# Altium project IoTProject_V1.1.PrjPcb (part 1 of 2)
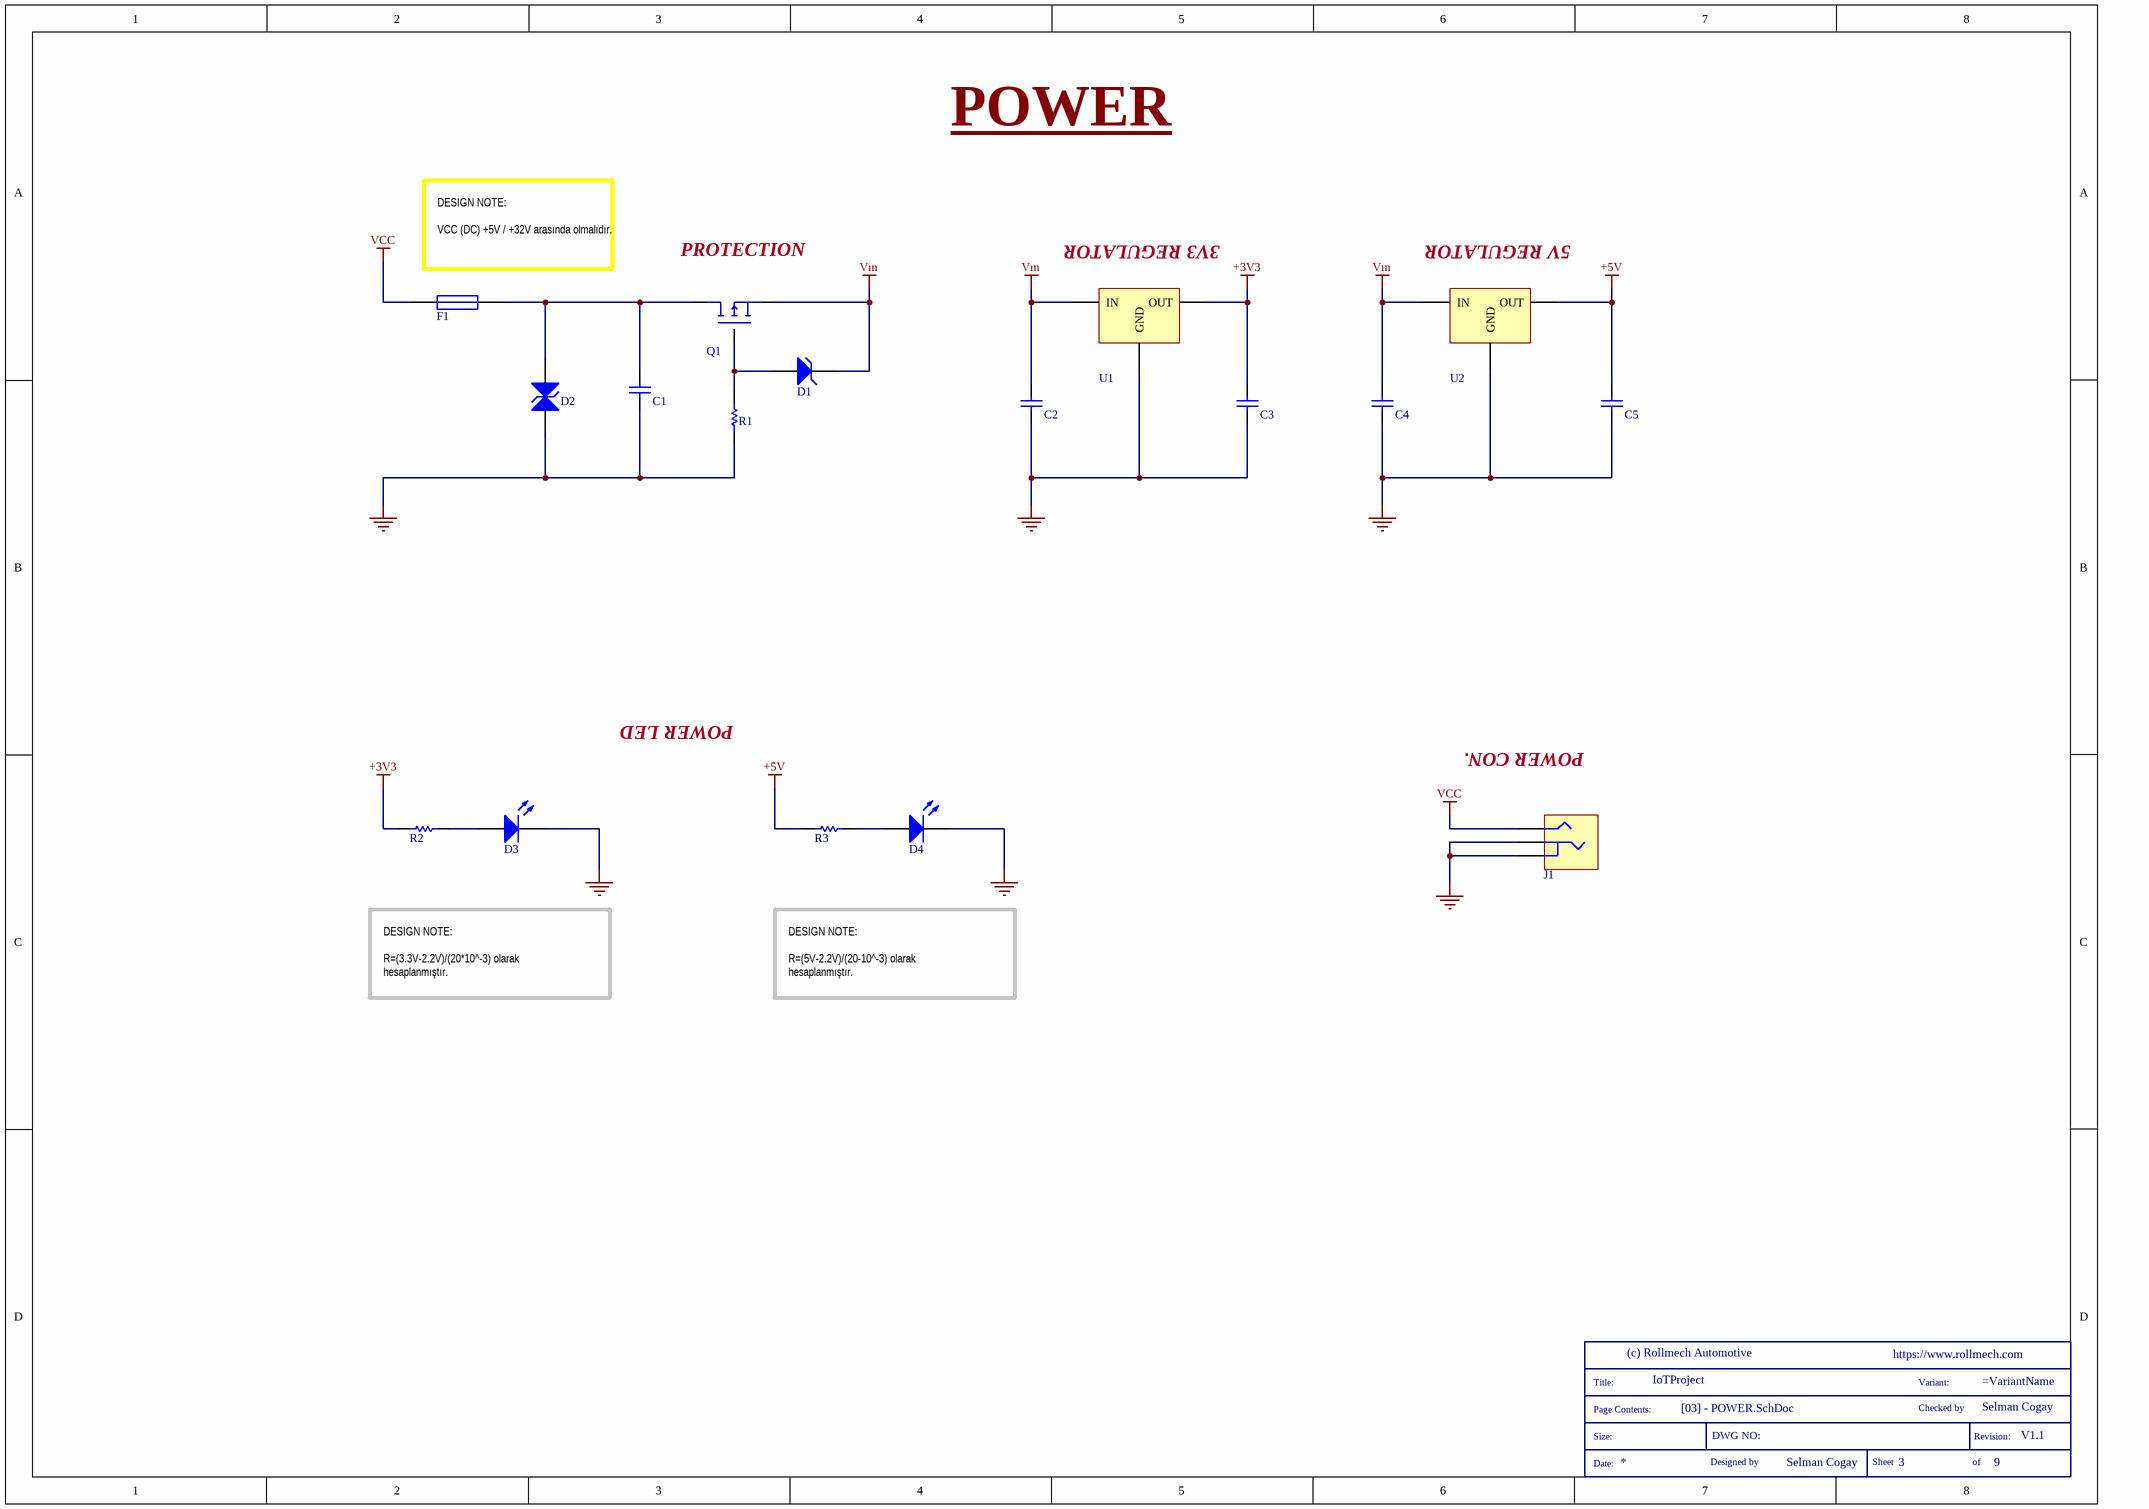
[diagram p0: [03] - POWER.SchDoc]
Company: (c) Rollmech Automotive; Designer: Selman Cogay; Proje: IoT-Project; Project: IoTProject; Released_Date: Released Date: 01.09.2020; VersionRevision: V1.1; WebSite: https://www.rollmech.com
6 sheets, 231 parts. Net scope: flat (ports and power ports of the same name join across sheets).
Sheets:
  [03] - POWER.SchDoc
  [04] - COMMUNICATION.SchDoc
  [05] - EEPROM-RTC-LCD.SchDoc
  [06] - INPUT.SchDoc
  [07] - OUTPUT.SchDoc
  [08] - MCU.SchDoc

## Sheet [03] - POWER.SchDoc
size A3; DocumentNumber: 3; SheetNumber: 3; SheetTotal: 9

### Parts
(Parts that share a designator on the sheet are numbered #1, #2 ... from top to bottom, then left to right.)
*#1  SCH_TITLE  (value not drawn)  (graphical)
C1  1uF 35V  [C0603]  (value not drawn)
C2  100nF 35V  [CAP_CER_0603]  (value not drawn)
C3  10uF 16V  [CAP_CER_0805]  (value not drawn)
C4  100nF 35V  [CAP_CER_0603]  (value not drawn)
C5  10uF 16V  [CAP_CER_0805]  (value not drawn)
D1  12V 250mW  [SOT-23 (TO-236)]  (value not drawn)
D2  33V3  [DO-214AB]  (value not drawn)
D3  LED RED  [PLCC2]  (value not drawn)
D4  LED RED  [PLCC2]  (value not drawn)
F1  1.25A 32VDC  [FUSE_0603]  (value not drawn)
J1  CONN 2x5.5 Jack  [POWER_JACK]  (value not drawn)
Q1  PNP 60V 36A  [PowerPak-SO8]  (value not drawn)
R1  100K 1/4W  [RES_0603]  (value not drawn)
R2  54.9 1/8W  [RES_0805]  (value not drawn)
R3  140 1/8W  [RES_0805]  (value not drawn)
U1  TLE4284DV33  [PG-TO252-3-11]  (value not drawn)
U2  TLE4284DV50  [PG-TO252-3-11]  (value not drawn)

### Nets
+3V3: C3.2 R2.1 U1.2(OUT)
+5V: C5.2 R3.1 U2.2(OUT)
GND: C1.1 C2.1 C3.1 C4.1 C5.1 D2.1(A) D3.2(K) D4.2(K) J1.2 J1.3 R1.1 U1.1(GND) U2.1(GND)
VCC: F1.1 J1.1
Vın: C2.2 C4.2 D1.3(K) Q1.1(S) U1.3(IN) U2.3(IN)
NetC1_2: C1.2 D2.2(K) F1.2 Q1.5(D)
NetD1_2: D1.2(A) Q1.4(G) R1.2
NetD3_1: D3.1(A) R2.2
NetD4_1: D4.1(A) R3.2

### Notes on the sheet
- POWER
- (near U1) 3V3 REGULATOR
- (near U2) 5V REGULATOR
- (near F1) DESIGN NOTE:
  VCC (DC) +5V / +32V arasında olmalıdır.
- (near Q1) PROTECTION
- POWER LED
- POWER CON.
- DESIGN NOTE:
  R=(3.3V-2.2V)/(20*10^-3) olarak hesaplanmıştır.
- DESIGN NOTE:
  R=(5V-2.2V)/(20-10^-3) olarak hesaplanmıştır.
- (in symbol SCH_TITLE) Title:; Variant:; Page Contents:; Checked by; Size:; DWG NO:; Revision:; Date:; Designed by; Sheet; of

### Library data of the parts
*#1 = SCH_TITLE: Schematic information
C1 = CGA3E3X5R1V105K080AB: CAP CER 1UF 35V; Manufacturer 1: TDK Corporation; Category: Ceramic Capacitors; Manufacture Part Number 1: CGA3E3X5R1V105K080AB; Case/Package: 0603 (1608 Metric); Quantity: 1; Supplier 1: Digikey; Supplier Part Number 1: 445-12484-1-ND; Supplier Order Qty 1: 1; Supplier Stock 1: 11910; Supplier Unit Price 1: 0,25; Supplier Currency 1: $
C2 C4 = GMK107BJ104KAHT: CAP CER 100nf 35V X5R 0603; Manufacturer 1: Taiyo Yuden; Category: Ceramic Capacitors; Manufacturer Part Number 1: GMK107BJ104KAHT; Case/Package: 0603 (1608 Metric); Quantity: 1; Supplier 1: Digikey; Supplier Part Number 1: 587-3357-1-ND; Supplier Order Qty 1: 1; Supplier Stock 1: 97932; Supplier Unit Price 1: 0,14; Supplier Currency 1: $
C3 C5 = CGA4J1X5R1C106M125AC: CAP CER 10UF 16V; Manufacturer 1: TDK Corporation; Category: Ceramic Capacitors; Manufacturer Part Number 1: CGA4J1X5R1C106M125AC; Case/Package: 0805 (2012 Metric); Quantity: 1; Supplier 1: Digikey; Supplier Part Number 1: 445-12654-1-ND; Supplier Order Qty 1: 1; Supplier Stock 1: 39905; Supplier Unit Price 1: 0,5; Supplier Currency 1: $
D1 = SZBZX84C12LT1G: DIODE ZENER 12V 250MW; Manufacturer 1: ON Semiconductor; Category: Diodes - Zener - Single; Manufacturer Part Number 1: SZBZX84C12LT1G; Case/Package: TO-236-3, SC-59, SOT-23-3; Quantity: 1; Supplier 1: Digikey; Supplier Part Number 1: SZBZX84C12LT1GOSCT-ND; Supplier Order Qty 1: 1; Supplier Stock 1: 80986; Supplier Unit Price 1: 0,15; Supplier Currency 1: $
D2 = SZP6SMB36CAT3G: TVS DIODE 30.8V 49.9V SMB; Manufacturer 1: Littelfuse Inc.; Category: TVS - Diodes; Manufacturer Part Number 1: SZP6SMB36CAT3G; Case/Package: DO-214AA, SMB; Quantity: 1; Supplier 1: Digikey; Supplier Part Number 1: SZP6SMB36CAT3GOSCT-ND; Supplier Order Qty 1: 1; Supplier Stock 1: 24611; Supplier Unit Price 1: 0,93; Supplier Currency 1: $
D3 D4 = LR T67D-U1V2-1-1-20-R18-Z: LED TOPLED RED 626NM 2PLCC; Manufacturer 1: OSRAM Opto Semiconductors Inc.; Category: LED Lighting - Color; Manufacturer Part Number 1: LR T67D-U1V2-1-1-20-R18-Z; Case/Package: 2-SMD, J-Lead; Quantity: 1; Supplier 1: Digikey; Supplier Part Number 1: 475-3762-1-ND; Supplier Order Qty 1: 1; Supplier Stock 1: 1905; Supplier Unit Price 1: 0,47; Supplier Currency 1: $
F1 = MFU0603FF01250P100: FUSE 1.25A 32VDC 0603; Manufacturer 1: Vishay Beyschlag; Category: Fuses; Manufacturer Part Number 1: MFU0603FF01250P100; Case/Package: 0603 (1608 Metric); Quantity: 1; Supplier 1: Digikey; Supplier Part Number 1: MFU06031.25CT-ND; Supplier Order Qty 1: 1; Supplier Stock 1: 24954; Supplier Unit Price 1: 0,31; Supplier Currency 1: $
J1 = PJ-002A: CONN PWR JACK 2X5.5MM SOLDER; Manufacturer 1: CUI Inc.; Category: Barrel - Power Connectors; Manufacturer Part Number 1: PJ-002A; Case/Package: Jack; Quantity: 1; Supplier 1: Digikey; Supplier Part Number 1: CP-002A-ND; Supplier Order Qty 1: 1; Supplier Stock 1: 115179; Supplier Unit Price 1: 0,6; Supplier Currency 1: $
Q1 = SQJ457EP-T1_GE3: MOSFET P-CH 60V 36A; Manufacturer 1: Vishay Siliconix; Category: Transistors - FETs, MOSFETs - Single; Manufacturer Part Number 1: SQJ457EP-T1_GE3; Case/Package: PowerPAK® SO-8; Quantity: 1; Supplier 1: Digikey; Supplier Part Number 1: SQJ457EP-T1_GE3CT-ND; Supplier Order Qty: 1; Supplier Stock 1: 24220; Supplier Unit Price 1: 0,92; Supplier Currency 1: $
R1 = ERJ-PA3J104V: RES SMD 100K 5% 1/4W 0603; Manufacturer 1: Panasonic Electronic Components; Category: Chip Resistor - Surface Mount; Manufacturer Part Number 1: ERJ-PA3J104V; Case/Package: 0603 (1608 Metric); Quantity: 1; Supplier 1: Digikey; Supplier Part Number 1: P100KBZCT-ND; Supplier Order Qty 1: 1; Supplier Stock 1: 11465; Supplier Unit Price 1: 0,11; Supplier Currency 1: $
R2 = ERJ-6ENF54R9V: RES SMD 54.9 OHM; Manufacturer 1: Panasonic Electronic Components; Category: Chip Resistor - Surface Mount; Manufacturer Part Number 1: ERJ-6ENF54R9V; Case/Package: 0805 (2012 Metric); Quantity: 1; Supplier 1: Digikey; Supplier Part Number 1: P54.9CCT-ND; Supplier Order Qty 1: 1; Supplier Stock 1: 43715; Supplier Unit Price 1: 0,1; Supplier Currency 1: $
R3 = ERJ-6ENF1400V: RES SMD 140 OHM 1% 1/8W 0805; Manufacturer 1: Panasonic Electronic Components; Category: Chip Resistor - Surface Mount; Manufacturer Part Number 1: ERJ-6ENF1400V; Case/Package: 0805 (2012 Metric); Quantity: 1; Supplier 1: Digikey; Supplier Part Number 1: P140CCT-ND; Supplier Order Qty 1: 1; Supplier Stock 1: 76818; Supplier Unit Price 1: 0,1; Supplier Currency 1: $
U1 = TLE4284DV33ATMA1: IC REG LINEAR 3.3V 1A; Manufacturer 1: Infineon Technologies; Category: PMIC - Voltage Regulators - Linear; Manufacturer Part Number 1: TLE4284DV33ATMA1; Case/Package: TO-252-3, DPak (2 Leads + Tab), SC-63; Quantity: 1; Supplier 1: Digikey; Supplier Part Number 1: TLE4284DV33ATMA1CT-ND; Supplier Order Qty 1: 1; Supplier Stock 1: 5062; Supplier Unit Price 1: 1,77; Supplier Currency 1: $
U2 = TLE4284DV50ATMA1: IC REG LINEAR 5V 1A; Manufacturer 1: Infineon Technologies; Category: PMIC - Voltage Regulators - Linear; Manufacturer Part Number 1: TLE4284DV50ATMA1; Case/Package: TO-252-3, DPak (2 Leads + Tab), SC-63; Quantity: 1; Supplier 1: Digikey; Supplier Part Number 1: TLE4284DV50ATMA1CT-ND; Supplier Order Qty 1: 1; Supplier Stock 1: 2563; Supplier Unit Price 1: 1,77; Supplier Currency 1: $

## Sheet [04] - COMMUNICATION.SchDoc
size A3; DocumentNumber: 4; SheetNumber: 4; SheetTotal: 9
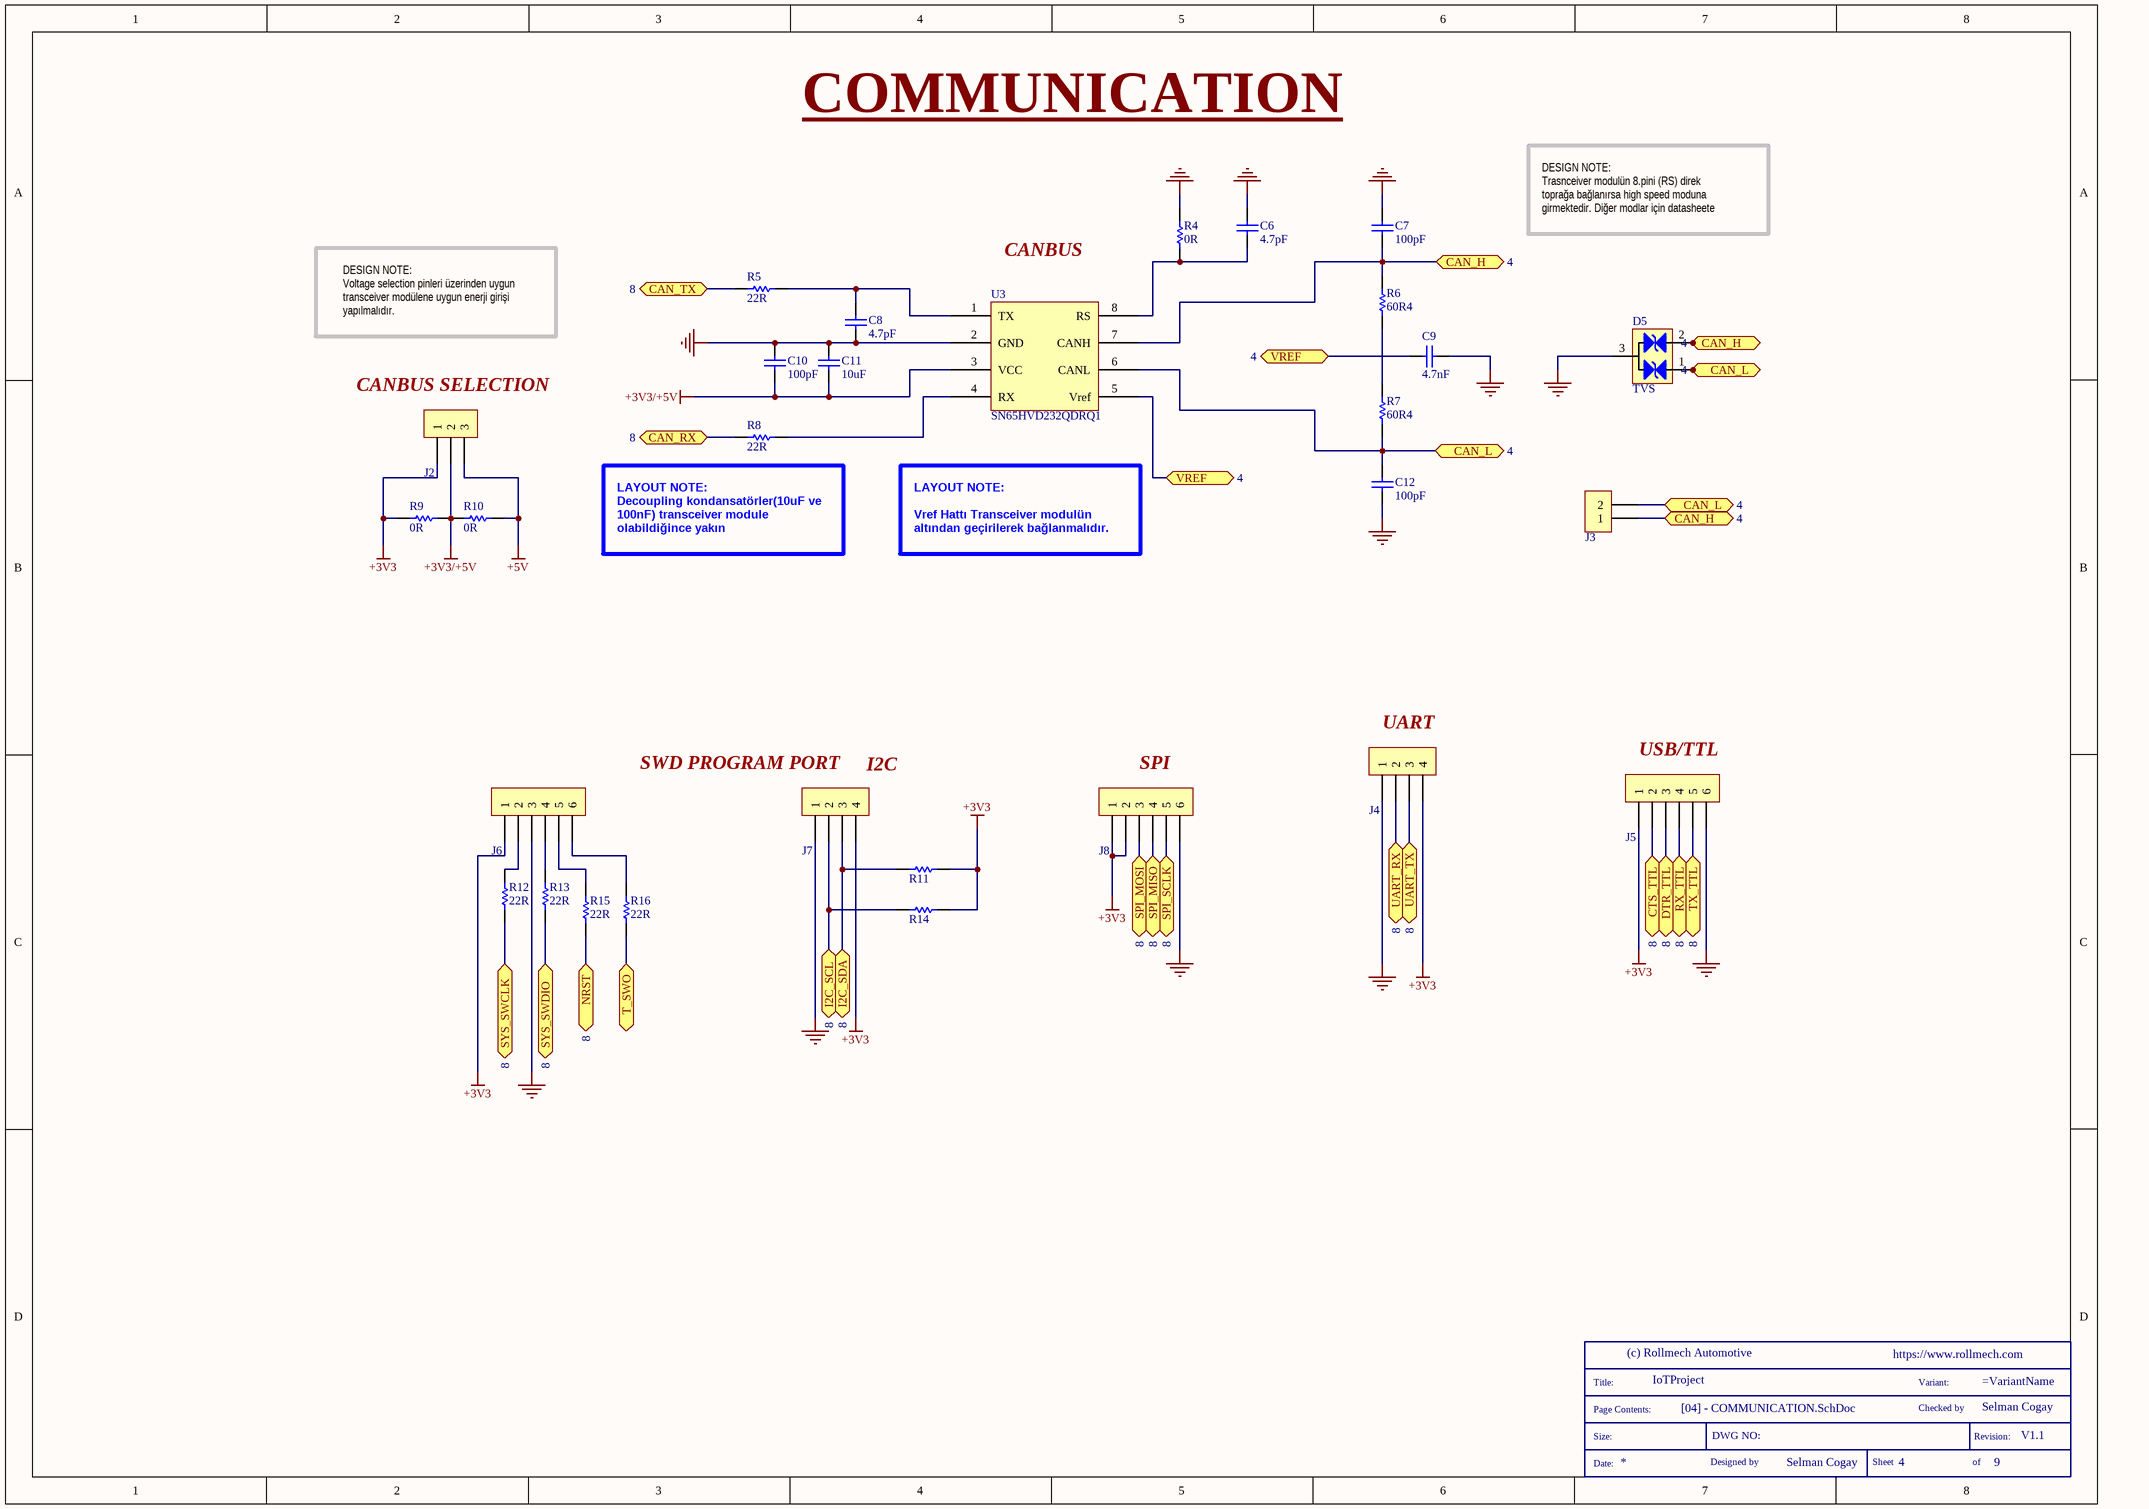
[diagram p1: [04] - COMMUNICATION.SchDoc]

### Parts
(Parts that share a designator on the sheet are numbered #1, #2 ... from top to bottom, then left to right.)
*#2  SCH_TITLE  (value not drawn)  (graphical)
C6  4.7pF  [C0603]
C7  100pF  [C0805]
C8  4.7pF  [C0603]
C9  4.7nF  [C0603]
C10  100pF  [C0805]
C11  10uF  [C0805]
C12  100pF  [C0805]
D5  TVS  [SOT23-3]
J2  HDR_1X3_2.54  [HDR_MALE_1X3_2.54MM]  (value not drawn)
J3  PPTC021LFBN-RC  [2POS_2.54mmPitch]  (value not drawn)
J4  HDR FEMALE 1X4 2.54MM  [HDR_FEMALE_1X4_2.54MM]  (value not drawn)
J5  HDR FEMALE 1X6 2.54MM  [HDR_FEMALE_1X6_2.54MM]  (value not drawn)
J6  HDR FEMALE 1X6 2.54MM  [HDR_FEMALE_1X6_2.54MM]  (value not drawn)
J7  HDR FEMALE 1X4 2.54MM  [HDR_FEMALE_1X4_2.54MM]  (value not drawn)
J8  HDR FEMALE 1X6 2.54MM  [HDR_FEMALE_1X6_2.54MM]  (value not drawn)
R4  0R  [R0805]
R5  22R  [R0805]
R6  60R4  [R0805]
R7  60R4  [R0805]
R8  22R  [R0805]
R9  0R  [R0805]
R10  0R  [R0805]
R11  5.6k 1/8W  [RES_0805]  (value not drawn)
R12  22R  [R0805]
R13  22R  [R0805]
R14  5.6k 1/8W  [RES_0805]  (value not drawn)
R15  22R  [R0805]
R16  22R  [R0805]
U3  SN65HVD232QDRQ1  [SOIC8]

### Ports
CAN_H (see 4), CAN_L (see 4), CAN_RX (see 8), CAN_TX (see 8), CTS_TTL (see 8), DTR_TTL (see 8), I2C_SCL (see 8), I2C_SDA (see 8), NRST (see 8), RX_TTL (see 8), SPI_MISO (see 8), SPI_MOSI (see 8), SPI_SCLK (see 8), SYS_SWCLK (see 8), SYS_SWDIO (see 8), T_SWO, TX_TTL (see 8), UART_RX (see 8), UART_TX (see 8), VREF (see 4)

### Nets
+3V3: J2.1 J4.4 J5.1 J6.1 J7.4 J8.1 J8.2 R9.1 R11.2 R14.2
+3V3/+5V: C10.1 C11.1 J2.2 R9.2 R10.2 U3.3(VCC)
+5V: J2.3 R10.1
GND: C6.2 C7.2 C8.1 C9.2 C10.2 C11.2 C12.1 D5.3 J4.1 J5.6 J6.3 J7.1 J8.6 R4.2 U3.2(GND)
NetC6_1: C6.1 R4.1 U3.8(RS)
NetC7_1: C7.1 J3.1 R6.2 U3.7(CANH) ; port CAN_H
NetC8_2: C8.2 R5.2 U3.1(TX)
NetC9_1: C9.1 U3.5(Vref) ; port VREF
NetC12_2: C12.2 J3.2 R7.1 U3.6(CANL) ; port CAN_L
NetC19_1: R15.1 ; port NRST
NetJ4_2: J4.2 ; port UART_RX
NetJ4_3: J4.3 ; port UART_TX
NetJ5_2: J5.2 ; port CTS_TTL
NetJ5_3: J5.3 ; port DTR_TTL
NetJ5_4: J5.4 ; port RX_TTL
NetJ5_5: J5.5 ; port TX_TTL
NetJ6_2: J6.2 R12.2
NetJ6_4: J6.4 R13.2
NetJ6_5: J6.5 R15.2
NetJ6_6: J6.6 R16.2
NetJ7_2: J7.2 R14.1 ; port I2C_SCL
NetJ7_3: J7.3 R11.1 ; port I2C_SDA
NetJ8_3: J8.3 ; port SPI_MOSI
NetJ8_4: J8.4 ; port SPI_MISO
NetJ8_5: J8.5 ; port SPI_SCLK
NetR5_1: R5.1 ; port CAN_TX
NetR6_1: R6.1 R7.2
NetR8_1: R8.1 ; port CAN_RX
NetR8_2: R8.2 U3.4(RX)
NetR12_1: R12.1 ; port SYS_SWCLK
NetR13_1: R13.1 ; port SYS_SWDIO
NetR16_1: R16.1 ; port T_SWO

Not connected (* = marked no-connect by the designer): D5 1 2

### Notes on the sheet
- COMMUNICATION
- DESIGN NOTE:
  Trasnceiver modulün 8.pini (RS) direk toprağa bağlanırsa high speed moduna girmektedir. Diğer modlar için datasheete bakınız
- CANBUS
- DESIGN NOTE:
  Voltage selection pinleri üzerinden uygun transceiver modülene uygun enerji girişi yapılmalıdır.
- (near J2) CANBUS SELECTION
- (near R8) LAYOUT NOTE:
  Decoupling kondansatörler(10uF ve 100nF) transceiver module olabildiğince yakın konumlandırılmalıdır.
- LAYOUT NOTE:
  Vref Hattı Transceiver modulün altından geçirilerek bağlanmalıdır.
- (near J6) SWD PROGRAM PORT
- (near J7) I2C
- (near J8) SPI
- (near J4) UART
- (near J5) USB/TTL
- (in symbol SCH_TITLE) Title:; Variant:; Page Contents:; Checked by; Size:; DWG NO:; Revision:; Date:; Designed by; Sheet; of

### Library data of the parts
*#2 = SCH_TITLE: Schematic information
C6 C8 = CGA3E2C0G1H4R7C080AA: CAP CER 4.7PF 50V C0G 0603; Manufacturer 1: TDK Corporation; Category: Ceramic Capacitors; Manufacturer Part Number 1: CGA3E2C0G1H4R7C080AA; Case/Package: 0603 (1608 Metric); Quantity: 2; Supplier 1: Digikey; Supplier Part Number 1: 445-5621-1-ND; Supplier Order Qty 1: 1; Supplier Stock 1: 2040; Supplier Unit Price 1: 0,21; Supplier Currency 1: $
C7 C10 C12 = CGJ4C2C0G2A101J060AA: CAP CER 100PF 100V C0G 0805; Manufacturer 1: TDK Corporation; Category: Ceramic Capacitors; Manufacturer Part Number 1: CGJ4C2C0G2A101J060AA; Case/Package: 0805 (2012 Metric); Quantity: 2; Descripiton: CAP CER 100PF 100V C0G 0805; Supplier 1: Digikey; Supplier Part Number 1: 445-9158-1-ND; Supplier Order Qty 1: 1; Supplier Stock 1: 8803; Supplier Unit Price 1: 0,32; Supplier Currency 1: $
C9 = CGA3E2X7R1H472K080AA: CAP CER 4700PF 50V X7R 0603; Manufacturer 1: TDK Corporation; Category: Ceramic Capacitors; Manufacturer Part Number 1: CGA3E2X7R1H472K080AA; Case/Package: 0603 (1608 Metric); Quantity: 1; Supplier 1: Digikey; Supplier Part Number 1: 445-5661-1-ND; Supplier Stock 1: 286028; Supplier Order Qty 1: 1; Supplier Unit Price 1: 0,21; Supplier Currency 1: $
C11 = CGA4J3X5R1A106K125AB: CAP CER 10UF 10V X5R 0805; Manufacturer 1: TDK Corporation; Category: Ceramic Capacitors; Manufacturer Part Number 1: CGA4J3X5R1A106K125AB; Case/Package: 0805 (2012 Metric); Quantity: 1; Supplier 1: Digikey; Supplier Part Number 1: 445-6970-1-ND; Supplier Order Qty 1: 1; Supplier Unit Price 1: 0,41; Supplier Currency 1: $; Supplier Stock 1: 278119
D5 = ESDCAN24-2BLY: TVS DIODE 24V 40V SOT23-3; Manufacturer 1: STMicroelectronics; Category: TVS - Diodes; Manufacturer Part Number 1: ESDCAN24-2BLY; Case/Package: TO-236-3, SC-59, SOT-23-3; Quantity: 1; Supplier 1: Digikey; Supplier Part Number 1: 497-13262-1-ND; Supplier Order Qty 1: 1; Supplier Stock 1: 89012; Supplier Unit Price 1: 0,39; Supplier Currency 1: $
J2 = 61300311121: HDR MALE 1X3 2.54MM; Manufacturer 1: Wurth Electronics Inc.; Category: Rectangular Connectors - Headers, Male Pins; Manufacturer Part Number 1: 61300311121; Case/Package: 3POS pitch 2.54mm; Quantity: 1; Supplier 1: Digikey; Supplier Part Number 1: 732-5316-ND; Supplier Order Qty 1: 1; Supplier Stock 1: 109116; Supplier Unit Price 1: 0,13; Supplier Currency 1: $
J3 = PPTC021LFBN-RC: 2POS 0.1 TIN PCB 2.54mm Pitch; Manufacturer 1: Sullins Connector Solutions; Category: Rectangular Connectors - Headers, Receptacles, Female Sockets; Manufacturer Part Number 1: PPTC021LFBN-RC; Case/Package: 2POS_2.54mmPitch; Quantity: 1; Supplier 1: Digikey; Supplier Part Number 1: S7000-ND; Supplier Order Qty 1: 1; Supplier Stock 1: 46723; Supplier Unit Price 1: 0,32; Supplier Currency 1: $
J4 J7 = PPTC041LFBN-RC: Manufacturer 1: Sullins Connector Solutions; Category: Rectangular Connectors - Headers, Receptacles, Female Sockets; Case/Package: 4POS_2.54mmPitch; Manufacturer Part Number 1: PPTC041LFBN-RC; Quantity: 1; Supplier 1: Digikey; Supplier Part Number 1: S7002-ND; Supplier Order Qty 1: 1; Supplier Stock 1: 30769; Supplier Unit Price 1: 0,45; Supplier Currency 1: $
J5 J6 J8 = PPTC061LFBN-RC: Manufacturer 1: Sullins Connector Solutions; Category: Rectangular Connectors - Headers, Receptacles, Female Sockets; Manufacturer Part Number 1: PPTC061LFBN-RC; Case/Package: 6Pos_2.5mm_Pitch; Quantity: 1; Supplier 1: Digikey; Supplier Part Number 1: S7004-ND; Supplier Order Qty 1: 1; Supplier Stock 1: 18444; Supplier Unit Price  1: 0,52; Supplier Currency 1: $
R4 R9 R10 = CRCW08050000Z0EA: RES SMD 0 OHM JUMPER 1/8W 0805; Manufacturer 1: Vishay Dale; Category: Chip Resistor - Surface Mount; Manufacturer Part Number 1: CRCW08050000Z0EA; Case/Package: 0805 (2012 Metric); Quantity: 1; Supplier 1: Digikey; Supplier Part Number 1: 541-0.0ACT-ND; Supplier Order Qty 1: 1; Supplier Stock 1: 609778; Supplier Unit Price 1: 0,10; Supplier Currency 1: $
R5 R8 R12 R13 R15 R16 = CRCW080522R0JNEA: RES SMD 22 OHM 5% 1/8W 0805; Manufacturer 1: Vishay Dale; Category: Chip Resistor - Surface Mount; Manufacturer Part Number 1: CRCW080522R0JNEA; Case/Package: 0805 (2012 Metric); Quantity: 2; Supplier 1: Digikey; Supplier Part Number 1: 541-22ACT-ND; Supplier Order Qty 1: 1; Supplier Stock 1: 53471; Supplier Unit Price 1: 0,10; Supplier Currency 1: $
R6 R7 = CRCW080560R4FKEA: RES SMD 60.4 OHM 1% 1/8W 0805; Manufacturer 1: Vishay Dale; Category: Chip Resistor - Surface Mount; Manufacturer Part Number 1: CRCW080560R4FKEA; Case/Package: 0805 (2012 Metric); Quantity: 2; Supplier 1: Digikey; Supplier Part Number 1: 541-60.4CCT-ND; Supplier Order Qty 1: 1; Supplier Stock 1: 49809; Supplier Unit Price 1: 0,10; Supplier Currency 1: $
R11 R14 = ERJ-6ENF5601V: RES SMD 5.6K OHM 1% 1/8W 0805; Manufacturer 1: Panasonic Electronic Components; Category: Chip Resistor - Surface Mount; Manufacturer Part Number 1: ERJ-6ENF5601V; Case/Package: 0805 (2012 Metric); Quantity: 1; Supplier 1: Digikey; Supplier Part Number 1: P5.60KCCT-ND; Supplier Order Qty 1: 1; Supplier Stock 1: 71341; Supplier Unit Price 1: 0,1; Supplier Currency 1: $
U3 = SN65HVD232QDRQ1: IC TXRX CAN 1MBPS 3.3V 8SOIC; Manufactuer 1: Texas Instruments; Category: Interface - Drivers, Receivers, Transceivers; Manufacturer Part Number 1: SN65HVD232QDRQ1; Case/Package: 8-SOIC (0.154", 3.90mm Width); Quantity: 1; Supplier 1: Digikey; Supplier Part Number 1: 296-15381-1-ND; Supplier Order Qty 1: 1; Supplier Stock 1: 16386; Supplier Unit Price 1: 2,37; Supplier Currency 1: $

## Sheet [05] - EEPROM-RTC-LCD.SchDoc
size A3; DocumentNumber: 5; SheetNumber: 5; SheetTotal: 9
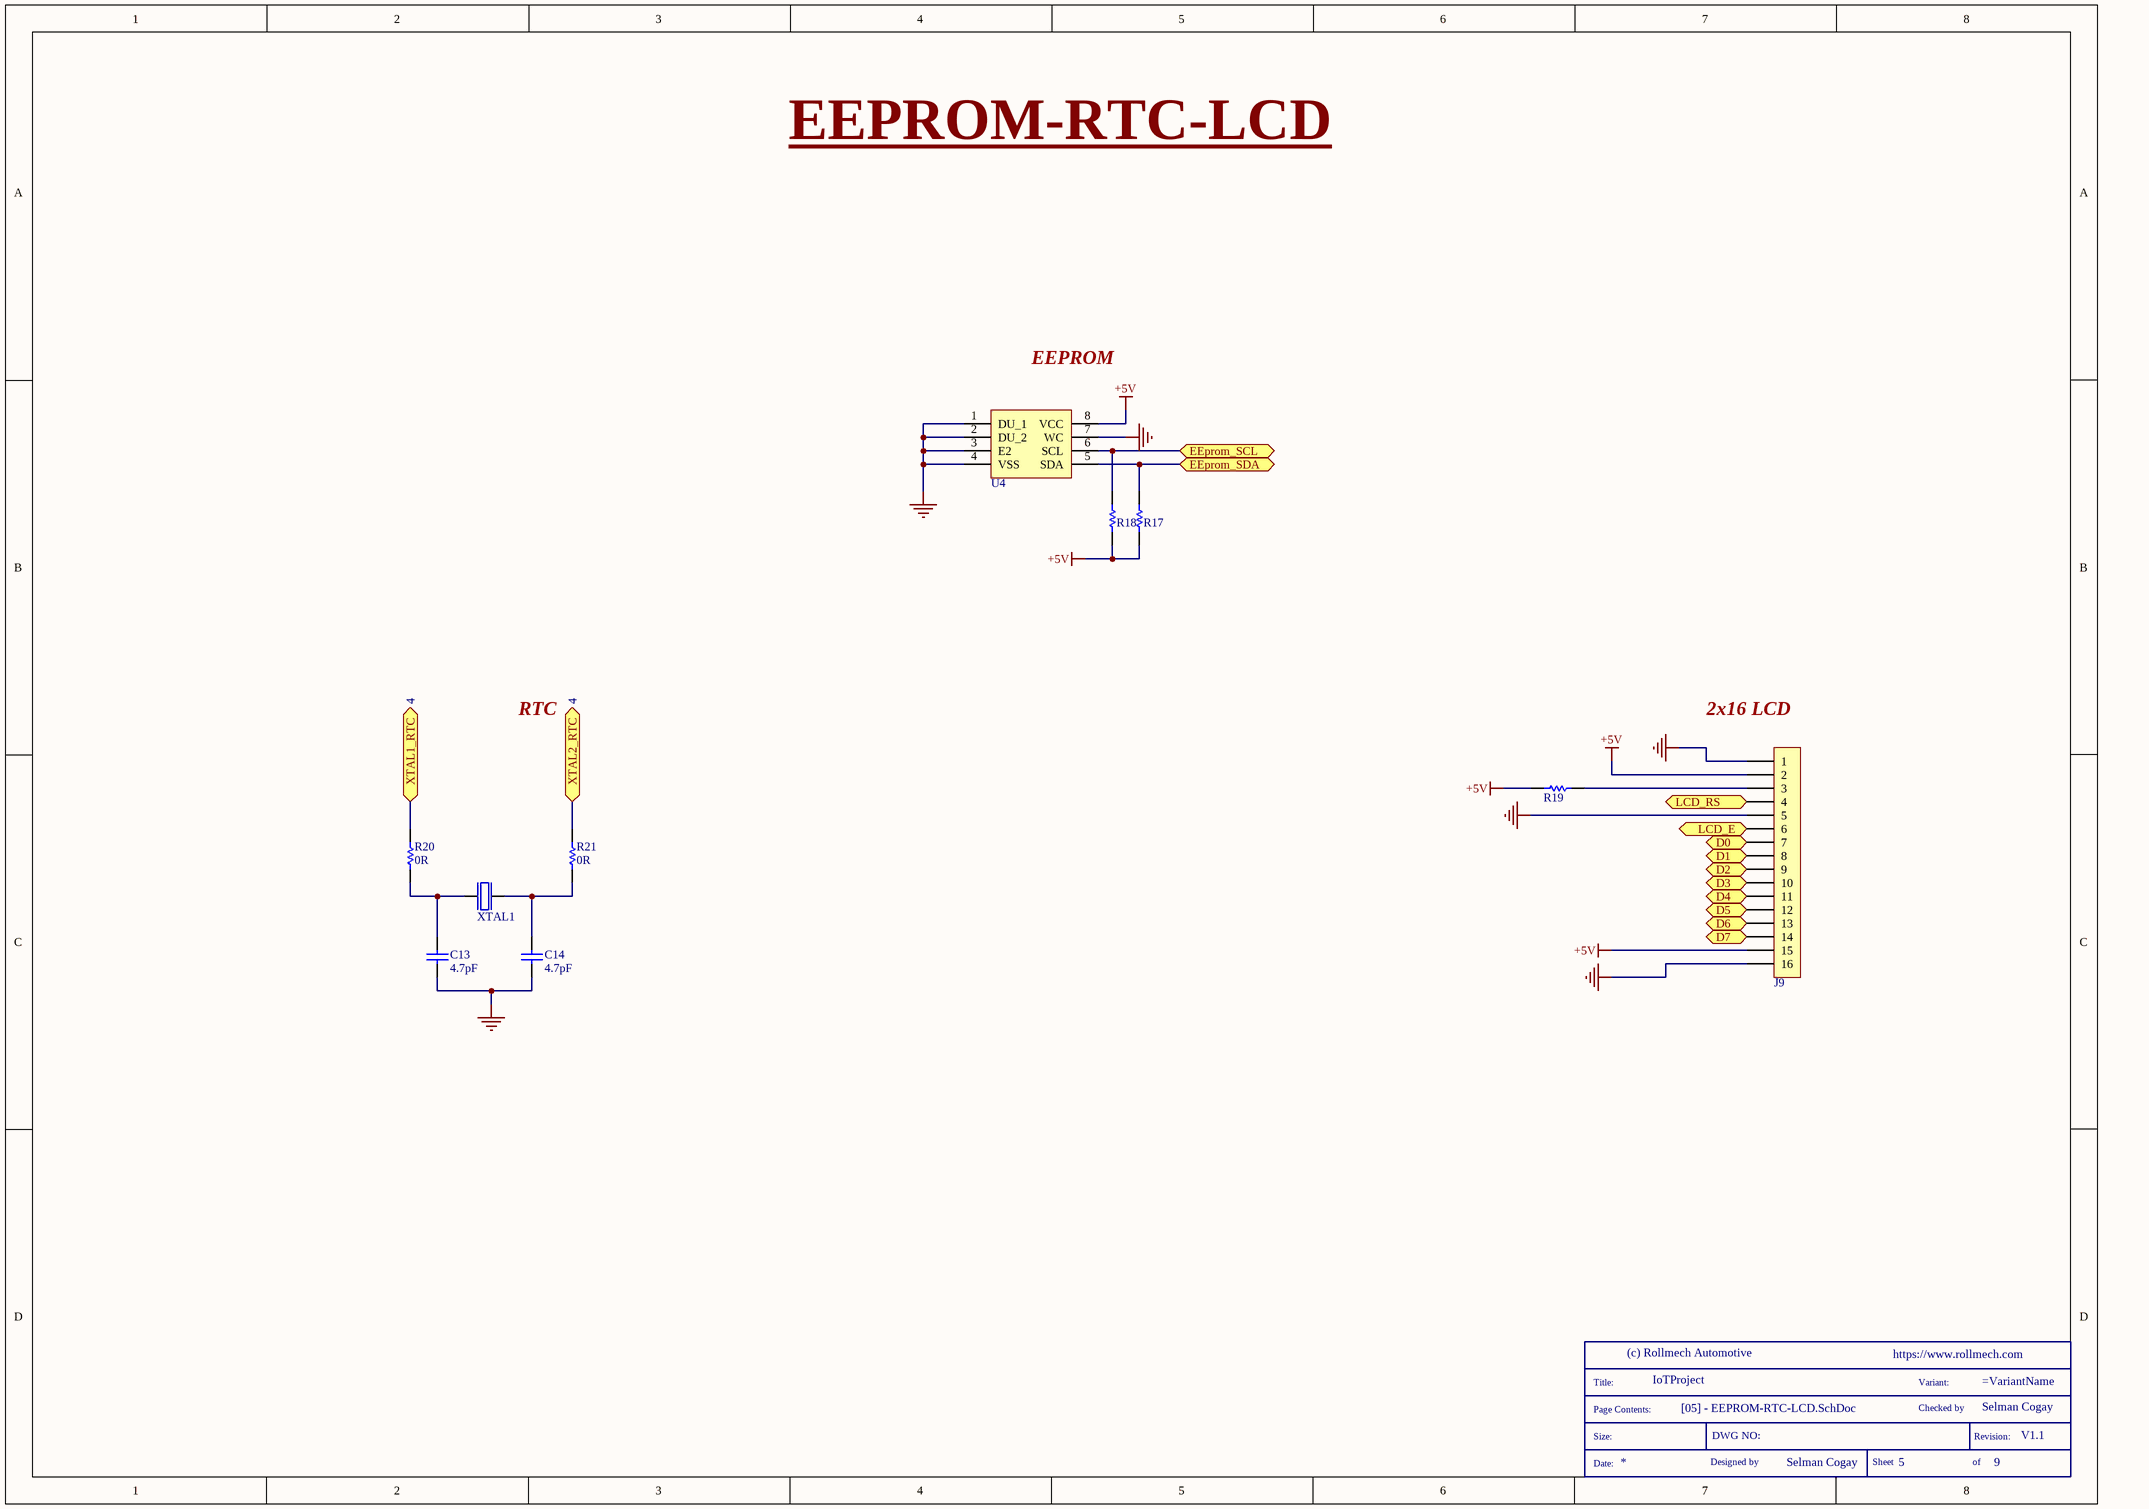
[diagram p2: [05] - EEPROM-RTC-LCD.SchDoc]

### Parts
(Parts that share a designator on the sheet are numbered #1, #2 ... from top to bottom, then left to right.)
*#3  SCH_TITLE  (value not drawn)  (graphical)
C13  4.7pF  [C0603]
C14  4.7pF  [C0603]
J9  HDR FEMALE 1x16 2.54MM  [HDR_FEMALE_1x16_2.54MM]  (value not drawn)
R17  5.6k 1/8W  [RES_0805]  (value not drawn)
R18  5.6k 1/8W  [RES_0805]  (value not drawn)
R19  1K 1/8W  [RES_0805]  (value not drawn)
R20  0R  [R0805]
R21  0R  [R0805]
U4  2M EEPROM  [SOIC-8]  (value not drawn)
XTAL1  32.768KHZ  [XTAL_2SMD]  (value not drawn)

### Ports
D0, D1, D2, D3, D4, D5, D6, D7, EEprom_SCL, EEprom_SDA, LCD_E, LCD_RS, XTAL1_RTC (see 4), XTAL2_RTC (see 4)

### Nets
+5V: J9.2 J9.15 R17.1 R18.1 R19.1 U4.8(VCC)
GND: C13.1 C14.1 J9.1 J9.5 J9.16 U4.1(DU_1) U4.2(DU_2) U4.3(E2) U4.4(VSS) U4.7(WC)
NetC13_2: C13.2 R20.1 XTAL1.1
NetC14_2: C14.2 R21.1 XTAL1.2
NetJ9_3: J9.3 R19.2
NetJ9_4: J9.4 ; port LCD_RS
NetJ9_6: J9.6 ; port LCD_E
NetJ9_7: J9.7 ; port D0
NetJ9_8: J9.8 ; port D1
NetJ9_9: J9.9 ; port D2
NetJ9_10: J9.10 ; port D3
NetJ9_11: J9.11 ; port D4
NetJ9_12: J9.12 ; port D5
NetJ9_13: J9.13 ; port D6
NetJ9_14: J9.14 ; port D7
NetR17_2: R17.2 U4.5(SDA) ; port EEprom_SDA
NetR18_2: R18.2 U4.6(SCL) ; port EEprom_SCL
NetR20_2: R20.2 ; port XTAL1_RTC
NetR21_2: R21.2 ; port XTAL2_RTC

### Notes on the sheet
- EEPROM-RTC-LCD
- EEPROM
- RTC
- 2x16 LCD
- (in symbol SCH_TITLE) Title:; Variant:; Page Contents:; Checked by; Size:; DWG NO:; Revision:; Date:; Designed by; Sheet; of

### Library data of the parts
*#3 = SCH_TITLE: Schematic information
C13 C14 = CGA3E2C0G1H4R7C080AA: as C6 on sheet [04] - COMMUNICATION; Category: Ceramic Capacitors; Manufacturer Part Number 1: CGA3E2C0G1H4R7C080AA; Case/Package: 0603 (1608 Metric); Quantity: 2; Supplier 1: Digikey; Supplier Part Number 1: 445-5621-1-ND; Supplier Order Qty 1: 1; Supplier Stock 1: 2040; Supplier Unit Price 1: 0,21; Supplier Currency 1: $
J9 = PPTC161LFBN-RC: Manufacturer 1: Sullins Connector Solutions; Category: Rectangular Connectors - Headers, Receptacles, Female Sockets; Manufacturer Part Number 1: PPTC161LFBN-RC; Case/Package: 16Pos_2.5mm_Pitch; Quantity: 1; Supplier 1: Digikey; Supplier Part Number 1: S7014-ND; Supplier Order Qty 1: 1; Supplier Stock 1: 9562; Supplier Unit Price  1: 0,98; Supplier Currency 1: $
R17 R18 = ERJ-6ENF5601V: as R11 on sheet [04] - COMMUNICATION; Category: Chip Resistor - Surface Mount; Manufacturer Part Number 1: ERJ-6ENF5601V; Case/Package: 0805 (2012 Metric); Quantity: 1; Supplier 1: Digikey; Supplier Part Number 1: P5.60KCCT-ND; Supplier Order Qty 1: 1; Supplier Stock 1: 71341; Supplier Unit Price 1: 0,1; Supplier Currency 1: $
R19 = ERJ-6ENF1001V: RES SMD 1K OHM; Manufacturer 1: Panasonic Electronic Components; Category: Chip Resistor - Surface Mount; Manufacturer Part Number 1: ERJ-6ENF1001V; Case/Package: 0805 (2012 Metric); Quantity: 1; Supplier 1: Digikey; Supplier Part Number 1: P1.00KCCT-ND; Supplier Order Qty 1: 1; Supplier Stock 1: 1361018; Supplier Unit Price 1: 0,1; Supplier Currency 1: $
R20 R21 = CRCW08050000Z0EA: as R4 on sheet [04] - COMMUNICATION; Category: Chip Resistor - Surface Mount; Manufacturer Part Number 1: CRCW08050000Z0EA; Case/Package: 0805 (2012 Metric); Quantity: 1; Supplier 1: Digikey; Supplier Part Number 1: 541-0.0ACT-ND; Supplier Order Qty 1: 1; Supplier Stock 1: 609778; Supplier Unit Price 1: 0,10; Supplier Currency 1: $
U4 = M24M02-DWMN3TP/K: IC EEPROM 2M I2C 1MHZ 8SO; Manufacturer 1: STMicroelectronics; Category: Memory; Manufacturer Part Number 1: M24M02-DWMN3TP/K; Case/Package: 8-SOIC (0.154", 3.90mm Width); Quantity: 1; Supplier 1: Digikey; Supplier Part Number 1: 497-16238-1-ND; Supplier Order Qty 1: 1; Supplier Stock 1: 6027; Supplier Unit Price 1: 3,28; Supplier Currency 1: $
XTAL1 = ECS-.327-6-34QCS-TR: CRYSTAL 32.768KHZ; Manufacturer 1: ECS Inc.; Category: Crystals; Manufacturer Part Number 1: ECS-.327-6-34QCS-TR; Case/Package: 2-SMD, No Lead; Quantity: 1; Supplier 1: Digikey; Supplier Part Number 1: XC2162CT-ND; Supplier Order Qty 1: 1; Supplier Stock 1: 1833; Supplier Unit Price 1: 0,83; Supplier Currency 1: $

## Sheet [06] - INPUT.SchDoc
size A3; DocumentNumber: 6; SheetNumber: 6; SheetTotal: 9
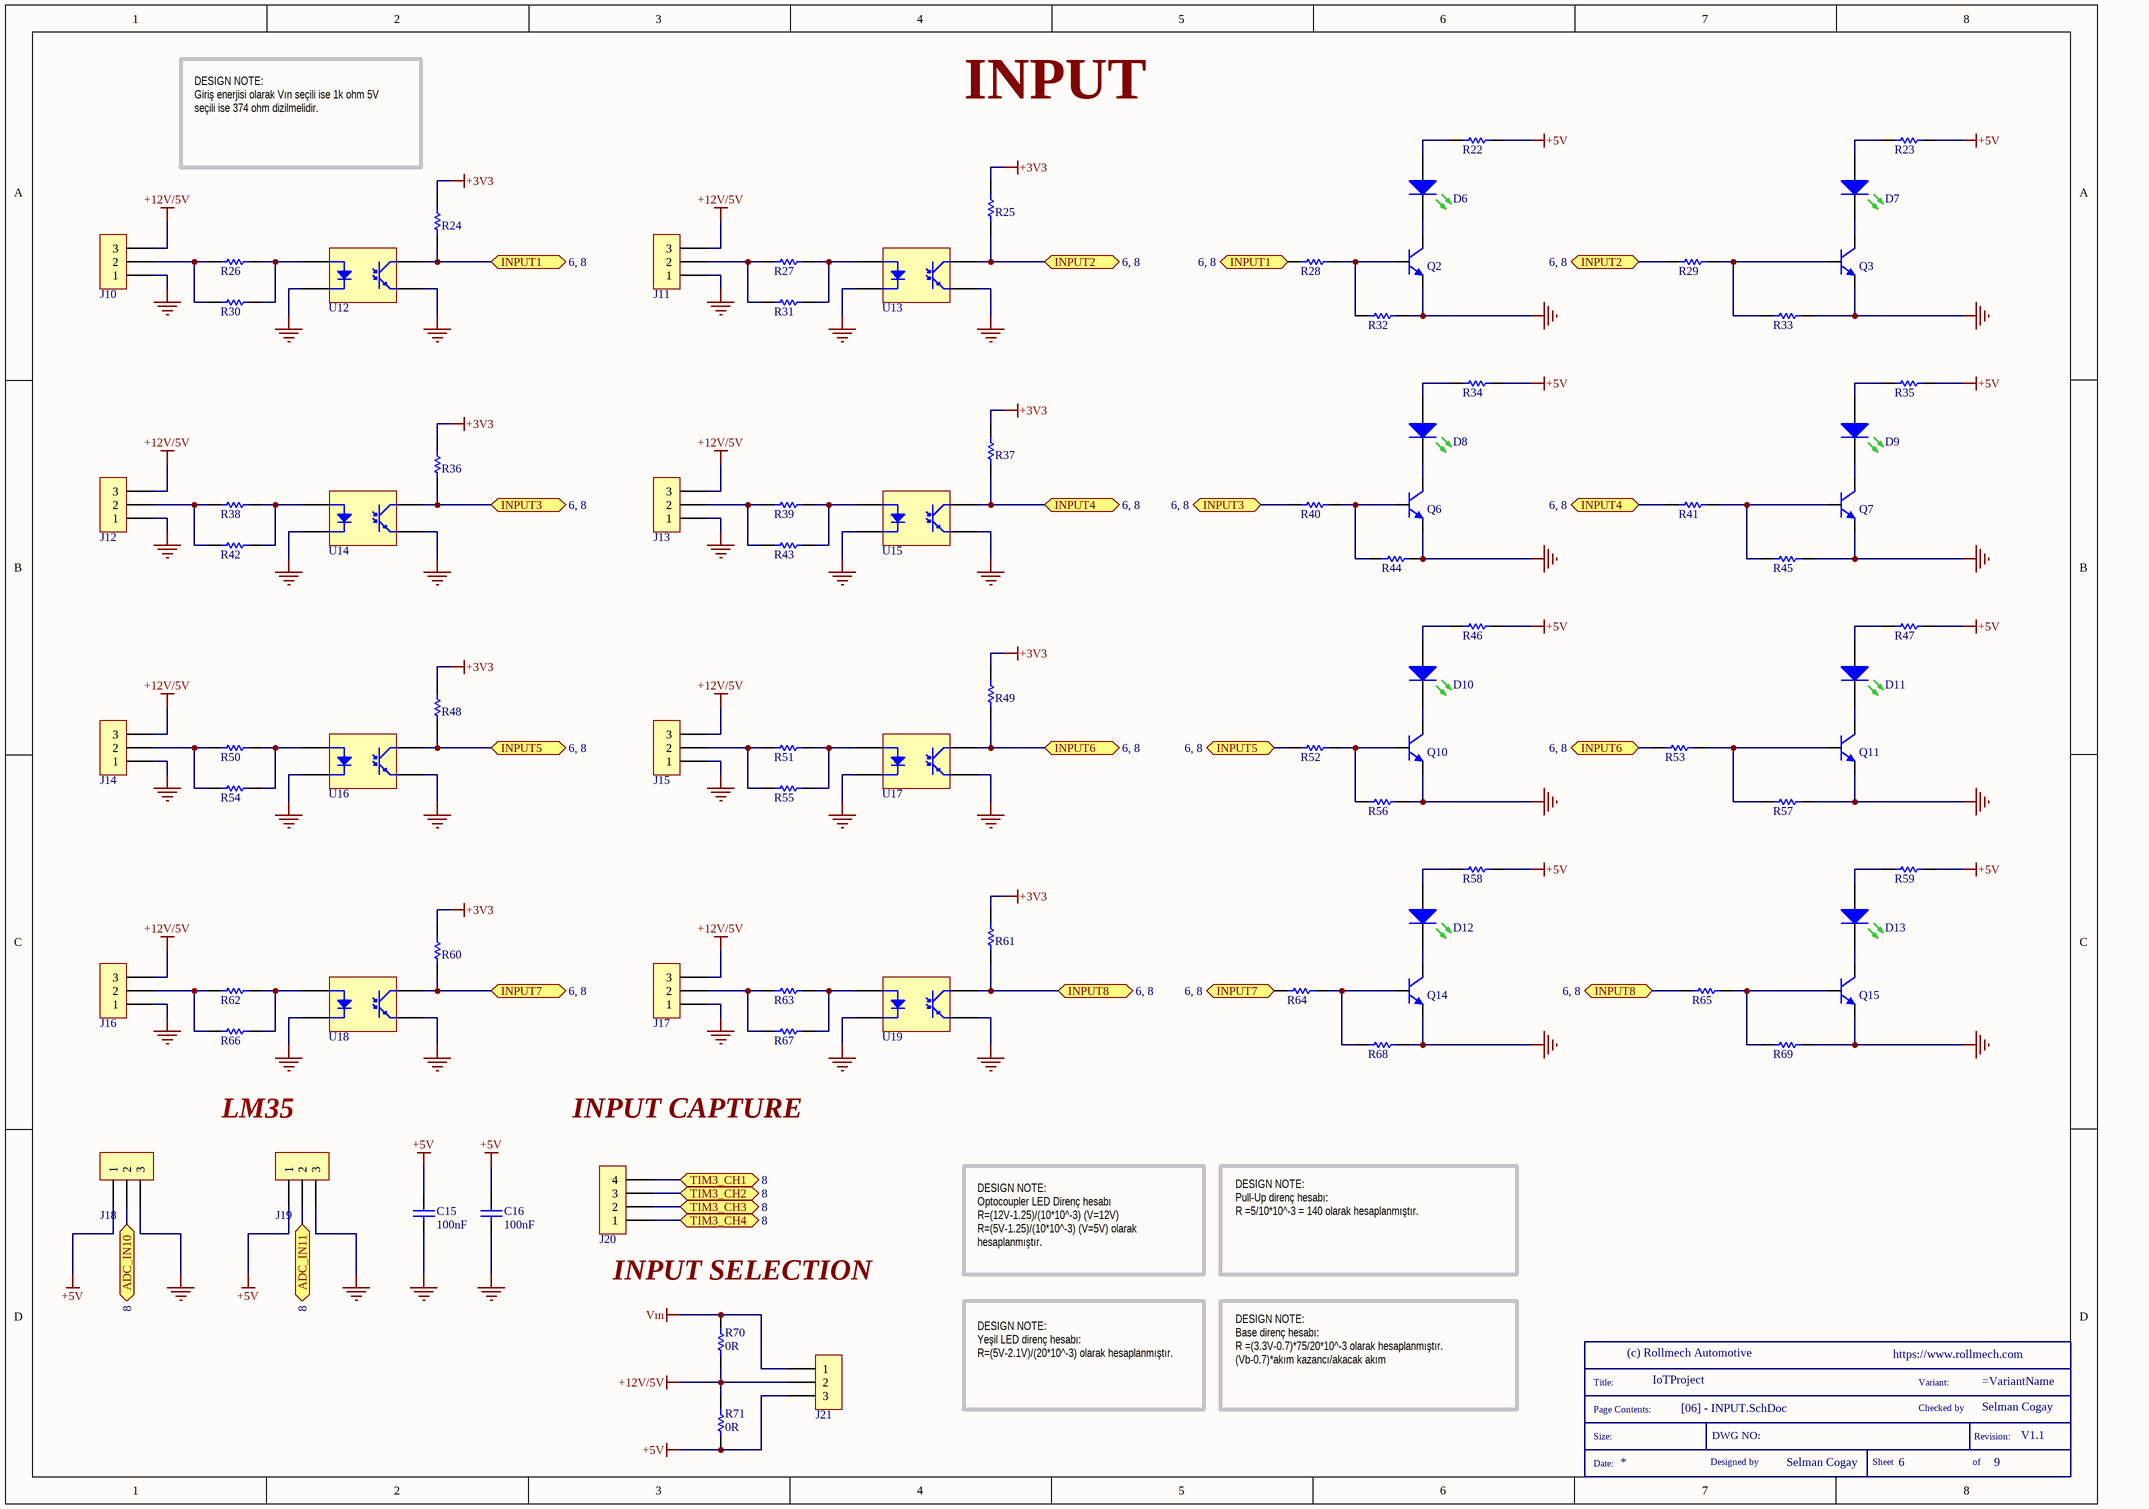
[diagram p3: [06] - INPUT.SchDoc]

### Parts
(Parts that share a designator on the sheet are numbered #1, #2 ... from top to bottom, then left to right.)
*#4  SCH_TITLE  (value not drawn)  (graphical)
C15  100nF  [C0603]
C16  100nF  [C0603]
D6  LED GREEN  [PLCC2]  (value not drawn)
D7  LED GREEN  [PLCC2]  (value not drawn)
D8  LED GREEN  [PLCC2]  (value not drawn)
D9  LED GREEN  [PLCC2]  (value not drawn)
D10  LED GREEN  [PLCC2]  (value not drawn)
D11  LED GREEN  [PLCC2]  (value not drawn)
D12  LED GREEN  [PLCC2]  (value not drawn)
D13  LED GREEN  [PLCC2]  (value not drawn)
J10  CONN 1X3 3MM  [CONN_MALE_1X3_3MM]  (value not drawn)
J11  CONN 1X3 3MM  [CONN_MALE_1X3_3MM]  (value not drawn)
J12  CONN 1X3 3MM  [CONN_MALE_1X3_3MM]  (value not drawn)
J13  CONN 1X3 3MM  [CONN_MALE_1X3_3MM]  (value not drawn)
J14  CONN 1X3 3MM  [CONN_MALE_1X3_3MM]  (value not drawn)
J15  CONN 1X3 3MM  [CONN_MALE_1X3_3MM]  (value not drawn)
J16  CONN 1X3 3MM  [CONN_MALE_1X3_3MM]  (value not drawn)
J17  CONN 1X3 3MM  [CONN_MALE_1X3_3MM]  (value not drawn)
J18  HDR_1X3_2.54  [HDR_MALE_1X3_2.54MM]  (value not drawn)
J19  HDR_1X3_2.54  [HDR_MALE_1X3_2.54MM]  (value not drawn)
J20  HDR FEMALE 1X4 2.54MM  [HDR_FEMALE_1X4_2.54MM]  (value not drawn)
J21  HDR_1X3_2.54  [HDR_MALE_1X3_2.54MM]  (value not drawn)
Q2  NPN 0.6A  [SOT-23 (TO-236)]  (value not drawn)
Q3  NPN 0.6A  [SOT-23 (TO-236)]  (value not drawn)
Q6  NPN 0.6A  [SOT-23 (TO-236)]  (value not drawn)
Q7  NPN 0.6A  [SOT-23 (TO-236)]  (value not drawn)
Q10  NPN 0.6A  [SOT-23 (TO-236)]  (value not drawn)
Q11  NPN 0.6A  [SOT-23 (TO-236)]  (value not drawn)
Q14  NPN 0.6A  [SOT-23 (TO-236)]  (value not drawn)
Q15  NPN 0.6A  [SOT-23 (TO-236)]  (value not drawn)
R22  140 1/8W  [RES_0805]  (value not drawn)
R23  140 1/8W  [RES_0805]  (value not drawn)
R24  5.6k 1/8W  [RES_0805]  (value not drawn)
R25  5.6k 1/8W  [RES_0805]  (value not drawn)
R26  1K 1/8W  [RES_0805]  (value not drawn)
R27  1K 1/8W  [RES_0805]  (value not drawn)
R28  10K 1/8W  [RES_0805]  (value not drawn)
R29  10K 1/8W  [RES_0805]  (value not drawn)
R30  374 1/8W  [RES_0805]  (value not drawn)
R31  374 1/8W  [RES_0805]  (value not drawn)
R32  100K 1/4W  [RES_0603]  (value not drawn)
R33  100K 1/4W  [RES_0603]  (value not drawn)
R34  140 1/8W  [RES_0805]  (value not drawn)
R35  140 1/8W  [RES_0805]  (value not drawn)
R36  5.6k 1/8W  [RES_0805]  (value not drawn)
R37  5.6k 1/8W  [RES_0805]  (value not drawn)
R38  1K 1/8W  [RES_0805]  (value not drawn)
R39  1K 1/8W  [RES_0805]  (value not drawn)
R40  10K 1/8W  [RES_0805]  (value not drawn)
R41  10K 1/8W  [RES_0805]  (value not drawn)
R42  374 1/8W  [RES_0805]  (value not drawn)
R43  374 1/8W  [RES_0805]  (value not drawn)
R44  100K 1/4W  [RES_0603]  (value not drawn)
R45  100K 1/4W  [RES_0603]  (value not drawn)
R46  140 1/8W  [RES_0805]  (value not drawn)
R47  140 1/8W  [RES_0805]  (value not drawn)
R48  5.6k 1/8W  [RES_0805]  (value not drawn)
R49  5.6k 1/8W  [RES_0805]  (value not drawn)
R50  1K 1/8W  [RES_0805]  (value not drawn)
R51  1K 1/8W  [RES_0805]  (value not drawn)
R52  10K 1/8W  [RES_0805]  (value not drawn)
R53  10K 1/8W  [RES_0805]  (value not drawn)
R54  374 1/8W  [RES_0805]  (value not drawn)
R55  374 1/8W  [RES_0805]  (value not drawn)
R56  100K 1/4W  [RES_0603]  (value not drawn)
R57  100K 1/4W  [RES_0603]  (value not drawn)
R58  140 1/8W  [RES_0805]  (value not drawn)
R59  140 1/8W  [RES_0805]  (value not drawn)
R60  5.6k 1/8W  [RES_0805]  (value not drawn)
R61  5.6k 1/8W  [RES_0805]  (value not drawn)
R62  1K 1/8W  [RES_0805]  (value not drawn)
R63  1K 1/8W  [RES_0805]  (value not drawn)
R64  10K 1/8W  [RES_0805]  (value not drawn)
R65  10K 1/8W  [RES_0805]  (value not drawn)
R66  374 1/8W  [RES_0805]  (value not drawn)
R67  374 1/8W  [RES_0805]  (value not drawn)
R68  100K 1/4W  [RES_0603]  (value not drawn)
R69  100K 1/4W  [RES_0603]  (value not drawn)
R70  0R  [R0805]
R71  0R  [R0805]
U12  NPN 3.75KV  [SOIC-6]  (value not drawn)
U13  NPN 3.75KV  [SOIC-6]  (value not drawn)
U14  NPN 3.75KV  [SOIC-6]  (value not drawn)
U15  NPN 3.75KV  [SOIC-6]  (value not drawn)
U16  NPN 3.75KV  [SOIC-6]  (value not drawn)
U17  NPN 3.75KV  [SOIC-6]  (value not drawn)
U18  NPN 3.75KV  [SOIC-6]  (value not drawn)
U19  NPN 3.75KV  [SOIC-6]  (value not drawn)

### Ports
ADC_IN10 (see 8), ADC_IN11 (see 8), INPUT1 (see 6, 8), INPUT2 (see 6, 8), INPUT3 (see 6, 8), INPUT4 (see 6, 8), INPUT5 (see 6, 8), INPUT6 (see 6, 8), INPUT7 (see 6, 8), INPUT8 (see 6, 8), TIM3_CH1 (see 8), TIM3_CH2 (see 8), TIM3_CH3 (see 8), TIM3_CH4 (see 8)

### Nets
+3V3: R24.2 R25.2 R36.2 R37.2 R48.2 R49.2 R60.2 R61.2
+5V: C15.2 C16.2 J18.1 J19.1 J21.3 R22.2 R23.2 R34.2 R35.2 R46.2 R47.2 R58.2 R59.2 R71.1
+12V/5V: J10.3 J11.3 J12.3 J13.3 J14.3 J15.3 J16.3 J17.3 J21.2 R70.1 R71.2
GND: C15.1 C16.1 J10.1 J11.1 J12.1 J13.1 J14.1 J15.1 J16.1 J17.1 J18.3 J19.3 Q2.3(E) Q3.3(E) Q6.3(E) Q7.3(E) Q10.3(E) Q11.3(E) Q14.3(E) Q15.3(E) R32.2 R33.2 R44.2 R45.2 R56.2 R57.2 R68.2 R69.2 U12.3(K) U12.4(Emit) U13.3(K) U13.4(Emit) U14.3(K) U14.4(Emit) U15.3(K) U15.4(Emit) U16.3(K) U16.4(Emit) U17.3(K) U17.4(Emit) U18.3(K) U18.4(Emit) U19.3(K) U19.4(Emit)
Vın: J21.1 R70.2
NetD6_1: D6.1(A) R22.1
NetD6_2: D6.2(K) Q2.1(C)
NetD7_1: D7.1(A) R23.1
NetD7_2: D7.2(K) Q3.1(C)
NetD8_1: D8.1(A) R34.1
NetD8_2: D8.2(K) Q6.1(C)
NetD9_1: D9.1(A) R35.1
NetD9_2: D9.2(K) Q7.1(C)
NetD10_1: D10.1(A) R46.1
NetD10_2: D10.2(K) Q10.1(C)
NetD11_1: D11.1(A) R47.1
NetD11_2: D11.2(K) Q11.1(C)
NetD12_1: D12.1(A) R58.1
NetD12_2: D12.2(K) Q14.1(C)
NetD13_1: D13.1(A) R59.1
NetD13_2: D13.2(K) Q15.1(C)
NetJ10_2: J10.2 R26.1 R30.1
NetJ11_2: J11.2 R27.1 R31.1
NetJ12_2: J12.2 R38.1 R42.1
NetJ13_2: J13.2 R39.1 R43.1
NetJ14_2: J14.2 R50.1 R54.1
NetJ15_2: J15.2 R51.1 R55.1
NetJ16_2: J16.2 R62.1 R66.1
NetJ17_2: J17.2 R63.1 R67.1
NetJ18_2: J18.2 ; port ADC_IN10
NetJ19_2: J19.2 ; port ADC_IN11
NetJ20_1: J20.1 ; port TIM3_CH4
NetJ20_2: J20.2 ; port TIM3_CH3
NetJ20_3: J20.3 ; port TIM3_CH2
NetJ20_4: J20.4 ; port TIM3_CH1
NetQ2_2: Q2.2(B) R28.2 R32.1
NetQ3_2: Q3.2(B) R29.2 R33.1
NetQ6_2: Q6.2(B) R40.2 R44.1
NetQ7_2: Q7.2(B) R41.2 R45.1
NetQ10_2: Q10.2(B) R52.2 R56.1
NetQ11_2: Q11.2(B) R53.2 R57.1
NetQ14_2: Q14.2(B) R64.2 R68.1
NetQ15_2: Q15.2(B) R65.2 R69.1
NetR24_1: R24.1 R28.1 U12.6(Coll) ; port INPUT1
NetR25_1: R25.1 R29.1 U13.6(Coll) ; port INPUT2
NetR26_2: R26.2 R30.2 U12.1(A)
NetR27_2: R27.2 R31.2 U13.1(A)
NetR36_1: R36.1 R40.1 U14.6(Coll) ; port INPUT3
NetR37_1: R37.1 R41.1 U15.6(Coll) ; port INPUT4
NetR38_2: R38.2 R42.2 U14.1(A)
NetR39_2: R39.2 R43.2 U15.1(A)
NetR48_1: R48.1 R52.1 U16.6(Coll) ; port INPUT5
NetR49_1: R49.1 R53.1 U17.6(Coll) ; port INPUT6
NetR50_2: R50.2 R54.2 U16.1(A)
NetR51_2: R51.2 R55.2 U17.1(A)
NetR60_1: R60.1 R64.1 U18.6(Coll) ; port INPUT7
NetR61_1: R61.1 R65.1 U19.6(Coll) ; port INPUT8
NetR62_2: R62.2 R66.2 U18.1(A)
NetR63_2: R63.2 R67.2 U19.1(A)

### Notes on the sheet
- INPUT
- DESIGN NOTE:
  Giriş enerjisi olarak Vın seçili ise 1k ohm 5V seçili ise 374 ohm dizilmelidir.
- LM35
- INPUT CAPTURE
- DESIGN NOTE:
  Optocoupler LED Direnç hesabı
  R=(12V-1.25)/(10*10^-3) (V=12V)
  R=(5V-1.25)/(10*10^-3) (V=5V) olarak hesaplanmıştır.
- DESIGN NOTE:
  Pull-Up direnç hesabı:
  R =5/10*10^-3 = 140 olarak hesaplanmıştır.
- INPUT SELECTION
- DESIGN NOTE:
  Yeşil LED direnç hesabı:
  R=(5V-2.1V)/(20*10^-3) olarak hesaplanmıştır.
- DESIGN NOTE:
  Base direnç hesabı:
  R =(3.3V-0.7)*75/20*10^-3 olarak hesaplanmıştır.
  (Vb-0.7)*akım kazancı/akacak akım
- (in symbol SCH_TITLE) Title:; Variant:; Page Contents:; Checked by; Size:; DWG NO:; Revision:; Date:; Designed by; Sheet; of

### Library data of the parts
*#4 = SCH_TITLE: Schematic information
C15 C16 = CGA3E2X7R1E104K080AA: CAP CER 0.1UF 25V X7R 0603; Manufacturer 1: TDK Corporation; Category: Ceramic Capacitors; Manufacturer Part Number 1: CGA3E2X7R1E104K080AA; Case/Package: 0603 (1608 Metric); Quantity: 1; Supplier 1: Digikey; Supplier Stock 1: 1909079; Supplier Part Number 1: 445-5667-1-ND; Supplier Order Qty 1: 1; Supplier Unit Price 1: 0,10; Supplier Currency 1: $
D6-D13 = LP T67F-P1R2-35-1-20-R18-Z: LED TOPLED GREEN 562NM 2PLCC; Manufacturer 1: OSRAM Opto Semiconductors Inc.; Category: LED Lighting - Color; Manufacturer Part Number 1: LP T67F-P1R2-35-1-20-R18-Z; Case/Package: 2-PLCC; Quantity: 1; Supplier 1: Digikey; Supplier Part Number 1: 475-3760-1-ND; Supplier Order Qty 1: 1; Supplier Stock 1: 1903; Supplier Unit Price 1: 0,67; Supplier Currency 1: $
J10-J17 = 66200311122: CONN MALE 1X3 3MM; Manufacturer 1: Wurth Electronics Inc.; Category: Rectangular Connectors - Headers, Male Pins; Manufacturer Part Number 1: 66200311122; Case/Package: 3POS_3mmPitch; Quantity: 1; Supplier 1: Digikey; Supplier Part Number 1: 732-4709-5-ND; Supplier Order Qty 1: 1; Supplier Stock 1: 56; Supplier Unit Price 1: 0,34; Supplier Currency 1: $
J18 J19 J21 = 61300311121: as J2 on sheet [04] - COMMUNICATION; Category: Rectangular Connectors - Headers, Male Pins; Manufacturer Part Number 1: 61300311121; Case/Package: 3POS pitch 2.54mm; Quantity: 1; Supplier 1: Digikey; Supplier Part Number 1: 732-5316-ND; Supplier Order Qty 1: 1; Supplier Stock 1: 109116; Supplier Unit Price 1: 0,13; Supplier Currency 1: $
J20 = PPTC041LFBN-RC: as J4 on sheet [04] - COMMUNICATION; Category: Rectangular Connectors - Headers, Receptacles, Female Sockets; Case/Package: 4POS_2.54mmPitch; Manufacturer Part Number 1: PPTC041LFBN-RC; Quantity: 1; Supplier 1: Digikey; Supplier Part Number 1: S7002-ND; Supplier Order Qty 1: 1; Supplier Stock 1: 30769; Supplier Unit Price 1: 0,45; Supplier Currency 1: $
Q2 Q3 Q6 Q7 Q10 Q11 Q14 Q15 = MMBT2222A-7-F: TRANS NPN 40V 0.6A SMD SOT23-3; Manufacturer 1: Diodes Incorporated; Category: Transistors - Bipolar (BJT) - Single; Manufacturer Part Number 1: MMBT2222A-7-F; Case/Package: SOT-23-3; Quantity: 1; Supplier 1: Digikey; Supplier Part Number 1: MMBT2222A-FDICT-ND; Supplier Order Qty 1: 1; Supplier Stock 1: 1957039; Supplier Unit Price 1: 0,14; Supplier Currency 1: $
R22 R23 R34 R35 R46 R47 R58 R59 = ERJ-6ENF1400V: as R3 on sheet [03] - POWER; Category: Chip Resistor - Surface Mount; Manufacturer Part Number 1: ERJ-6ENF1400V; Case/Package: 0805 (2012 Metric); Quantity: 1; Supplier 1: Digikey; Supplier Part Number 1: P140CCT-ND; Supplier Order Qty 1: 1; Supplier Stock 1: 76818; Supplier Unit Price 1: 0,1; Supplier Currency 1: $
R24 R25 R36 R37 R48 R49 R60 R61 = ERJ-6ENF5601V: as R11 on sheet [04] - COMMUNICATION; Category: Chip Resistor - Surface Mount; Manufacturer Part Number 1: ERJ-6ENF5601V; Case/Package: 0805 (2012 Metric); Quantity: 1; Supplier 1: Digikey; Supplier Part Number 1: P5.60KCCT-ND; Supplier Order Qty 1: 1; Supplier Stock 1: 71341; Supplier Unit Price 1: 0,1; Supplier Currency 1: $
R26 R27 R38 R39 R50 R51 R62 R63 = ERJ-6ENF1001V: as R19 on sheet [05] - EEPROM-RTC-LCD; Category: Chip Resistor - Surface Mount; Manufacturer Part Number 1: ERJ-6ENF1001V; Case/Package: 0805 (2012 Metric); Quantity: 1; Supplier 1: Digikey; Supplier Part Number 1: P1.00KCCT-ND; Supplier Order Qty 1: 1; Supplier Stock 1: 1361018; Supplier Unit Price 1: 0,1; Supplier Currency 1: $
R28 R29 R40 R41 R52 R53 R64 R65 = ERJ-6ENF1002V: RES SMD 10K OHM 1% 1/8W 0805; Manufacturer 1: Panasonic Electronic Components; Category: Chip Resistor - Surface Mount; Manufacturer Part Number 1: ERJ-6ENF1002V; Case/Package: 0805 (2012 Metric); Quantity: 1; Supplier 1: Digikey; Supplier Part Number 1: P10.0KCCT-ND; Supplier Order Qty 1: 1; Supplier Stock 1: 2515107; Supplier Unit Price 1: 0,1; Supplier Currency 1: $
R30 R31 R42 R43 R54 R55 R66 R67 = ERJ-6ENF3740V: RES SMD 374 OHM 1% 1/8W 0805; Manufacturer 1: Panasonic Electronic Components; Category: Chip Resistor - Surface Mount; Manufacturer Part Number 1: ERJ-6ENF3740V; Case/Package: 0805 (2012 Metric); Quantity: 1; Supplier 1: Digikey; Supplier Order Qty 1: 1; Supplier Stock 1: 100272; Supplier Unit Price 1: 0,1; Supplier Currency 1: $; Supplier Part Number 1: P374CCT-ND
R32 R33 R44 R45 R56 R57 R68 R69 = ERJ-PA3J104V: as R1 on sheet [03] - POWER; Category: Chip Resistor - Surface Mount; Manufacturer Part Number 1: ERJ-PA3J104V; Case/Package: 0603 (1608 Metric); Quantity: 1; Supplier 1: Digikey; Supplier Part Number 1: P100KBZCT-ND; Supplier Order Qty 1: 1; Supplier Stock 1: 11465; Supplier Unit Price 1: 0,11; Supplier Currency 1: $
R70 R71 = CRCW08050000Z0EA: as R4 on sheet [04] - COMMUNICATION; Category: Chip Resistor - Surface Mount; Manufacturer Part Number 1: CRCW08050000Z0EA; Case/Package: 0805 (2012 Metric); Quantity: 1; Supplier 1: Digikey; Supplier Part Number 1: 541-0.0ACT-ND; Supplier Order Qty 1: 1; Supplier Stock 1: 609778; Supplier Unit Price 1: 0,10; Supplier Currency 1: $
U12-U19 = TLP2301(TPL,E: OPTOISO 3.75KV TRANS; Manufacturer 1: Toshiba Semiconductor and Storage; Category: Optoisolators - Transistor, Photovoltaic Output; Manufacturer Part Number 1: TLP2301(TPL,E; Case/Package: 6-SOIC (0.179", 4.55mm Width), 4 Leads; Quantity: 1; Supplier 1: Digikey; Supplier Part Number 1: TLP2301(TPLECT-ND; Supplier Order Qty 1: 1; Supplier Stock 1: 19225; Supplier Unit Price 1: 0,73; Supplier Currency 1: $

## Sheet [07] - OUTPUT.SchDoc
size A3; DocumentNumber: 7; SheetNumber: 7; SheetTotal: 9
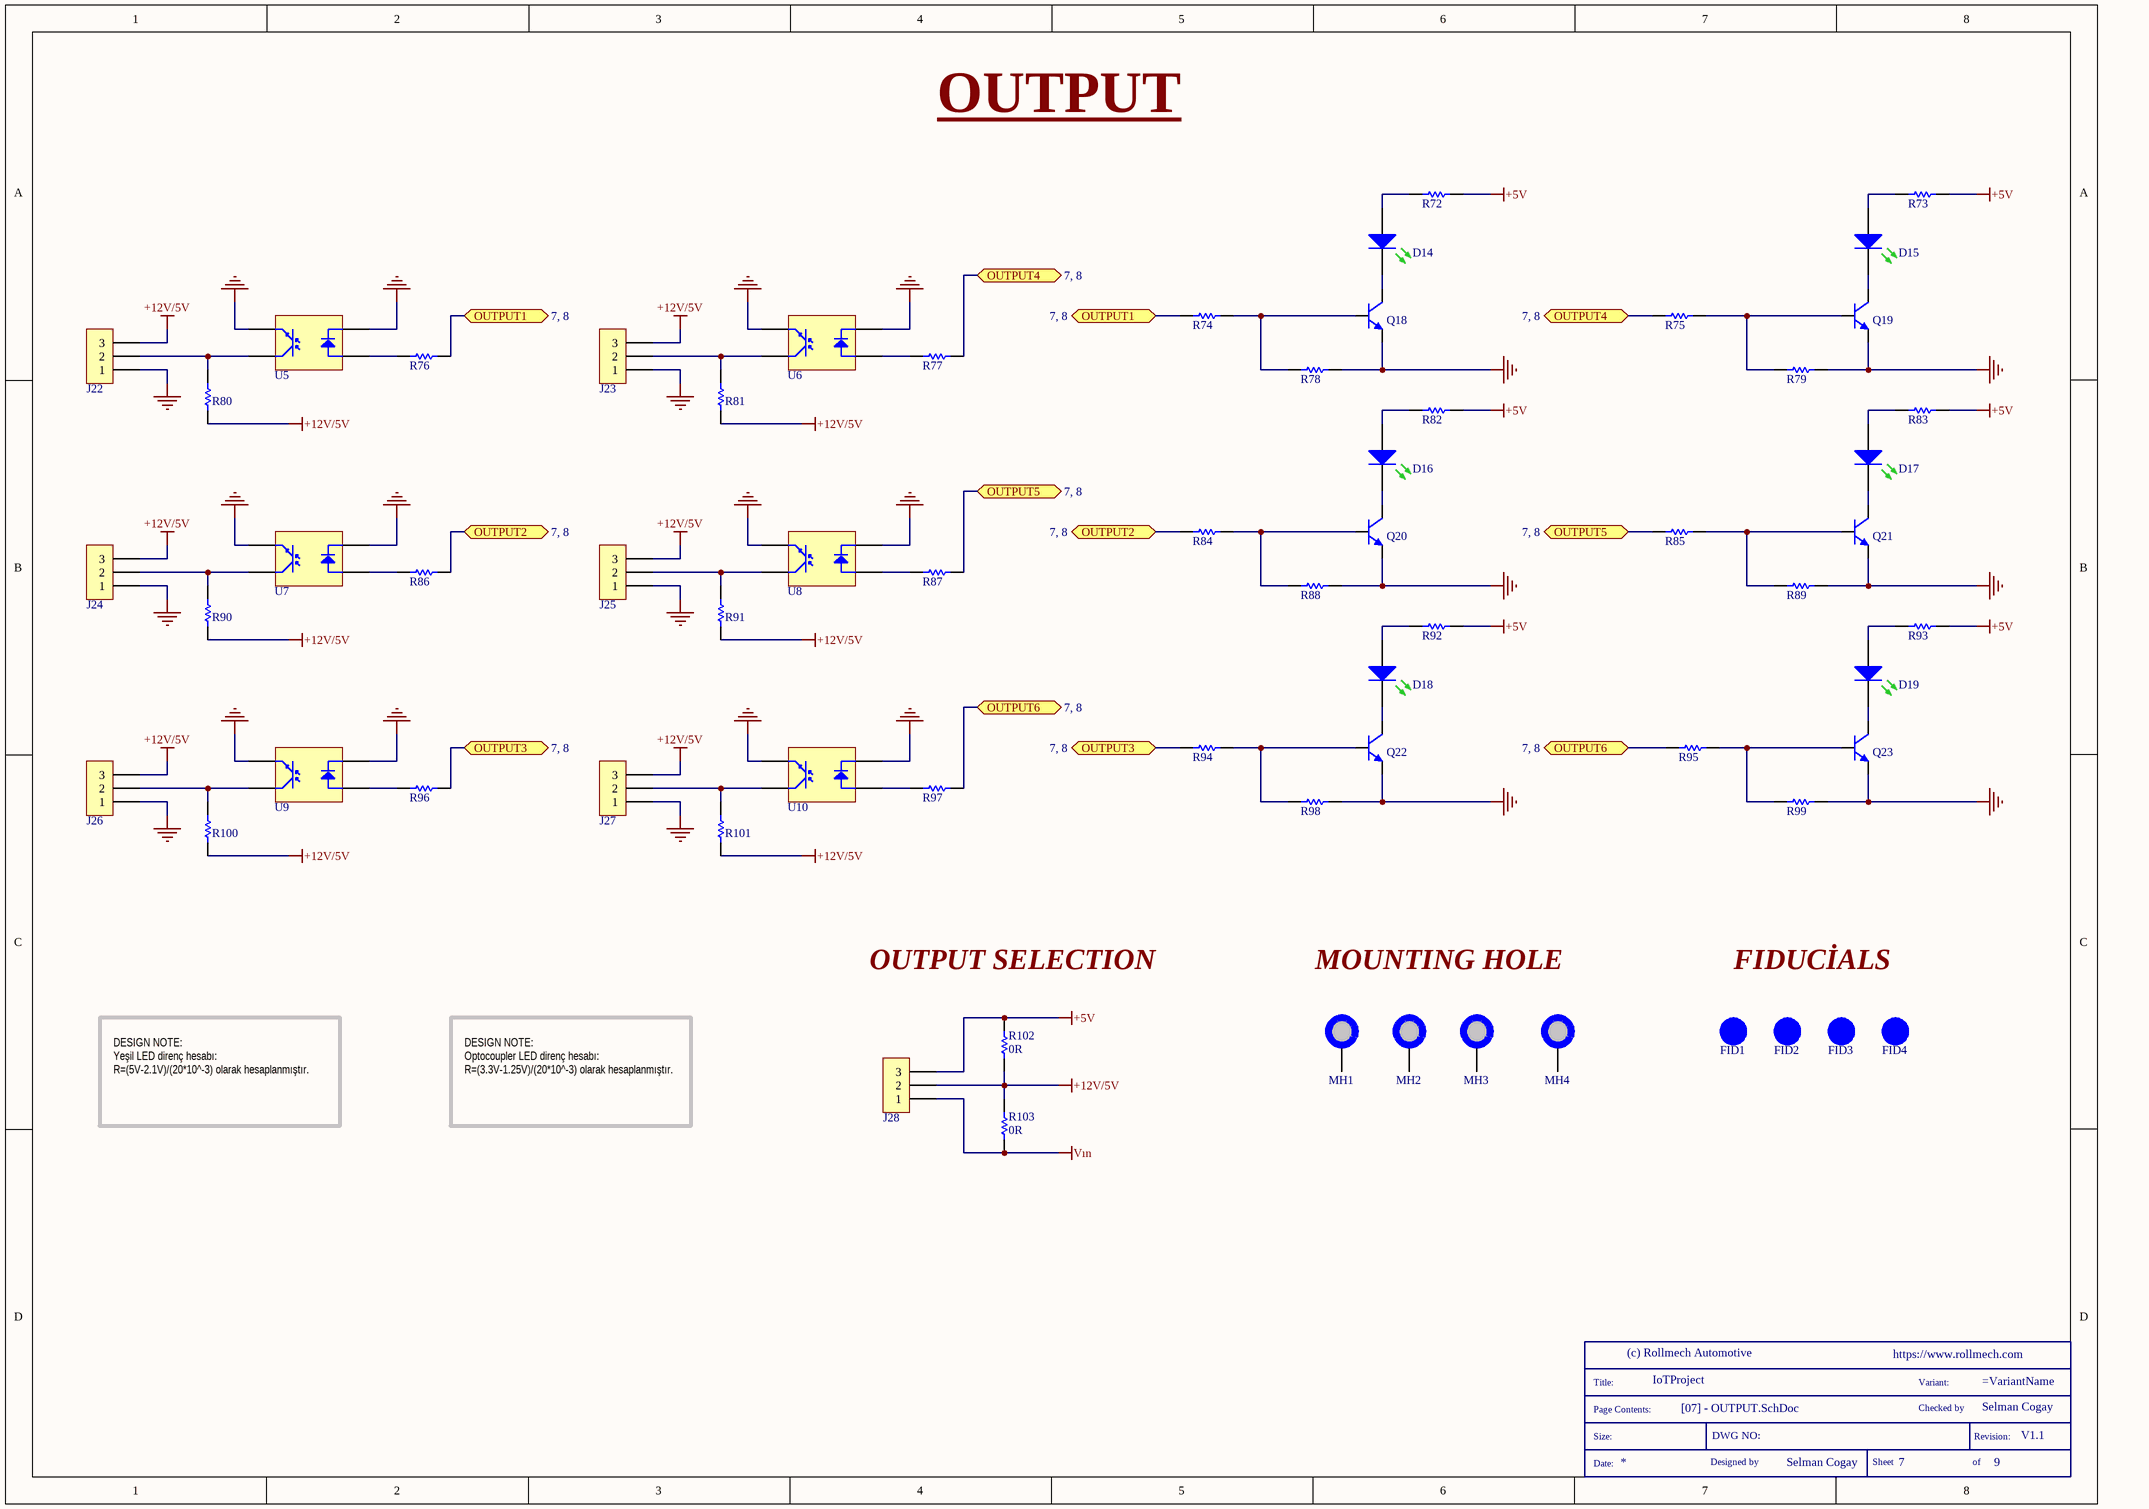
[diagram p4: [07] - OUTPUT.SchDoc]

### Parts
(Parts that share a designator on the sheet are numbered #1, #2 ... from top to bottom, then left to right.)
*#5  SCH_TITLE  (value not drawn)  (graphical)
D14  LED GREEN  [PLCC2]  (value not drawn)
D15  LED GREEN  [PLCC2]  (value not drawn)
D16  LED GREEN  [PLCC2]  (value not drawn)
D17  LED GREEN  [PLCC2]  (value not drawn)
D18  LED GREEN  [PLCC2]  (value not drawn)
D19  LED GREEN  [PLCC2]  (value not drawn)
FID1  FID_1MMC  [FID_40x120D]  (value not drawn)  (no BOM)
FID2  FID_1MMC  [FID_40x120D]  (value not drawn)  (no BOM)
FID3  FID_1MMC  [FID_40x120D]  (value not drawn)  (no BOM)
FID4  FID_1MMC  [FID_40x120D]  (value not drawn)  (no BOM)
J22  CONN 1X3 3MM  [CONN_MALE_1X3_3MM]  (value not drawn)
J23  CONN 1X3 3MM  [CONN_MALE_1X3_3MM]  (value not drawn)
J24  CONN 1X3 3MM  [CONN_MALE_1X3_3MM]  (value not drawn)
J25  CONN 1X3 3MM  [CONN_MALE_1X3_3MM]  (value not drawn)
J26  CONN 1X3 3MM  [CONN_MALE_1X3_3MM]  (value not drawn)
J27  CONN 1X3 3MM  [CONN_MALE_1X3_3MM]  (value not drawn)
J28  HDR_1X3_2.54  [HDR_MALE_1X3_2.54MM]  (value not drawn)
MH1  MH_3mm  [MH_3MM]  (value not drawn)  (no BOM)
MH2  MH_3mm  [MH_3MM]  (value not drawn)  (no BOM)
MH3  MH_3mm  [MH_3MM]  (value not drawn)  (no BOM)
MH4  MH_3mm  [MH_3MM]  (value not drawn)  (no BOM)
Q18  NPN 0.6A  [SOT-23 (TO-236)]  (value not drawn)
Q19  NPN 0.6A  [SOT-23 (TO-236)]  (value not drawn)
Q20  NPN 0.6A  [SOT-23 (TO-236)]  (value not drawn)
Q21  NPN 0.6A  [SOT-23 (TO-236)]  (value not drawn)
Q22  NPN 0.6A  [SOT-23 (TO-236)]  (value not drawn)
Q23  NPN 0.6A  [SOT-23 (TO-236)]  (value not drawn)
R72  140 1/8W  [RES_0805]  (value not drawn)
R73  140 1/8W  [RES_0805]  (value not drawn)
R74  10K 1/8W  [RES_0805]  (value not drawn)
R75  10K 1/8W  [RES_0805]  (value not drawn)
R76  100 1/8W  [RES_0805]  (value not drawn)
R77  100 1/8W  [RES_0805]  (value not drawn)
R78  100K 1/4W  [RES_0603]  (value not drawn)
R79  100K 1/4W  [RES_0603]  (value not drawn)
R80  5.6k 1/8W  [RES_0805]  (value not drawn)
R81  5.6k 1/8W  [RES_0805]  (value not drawn)
R82  140 1/8W  [RES_0805]  (value not drawn)
R83  140 1/8W  [RES_0805]  (value not drawn)
R84  10K 1/8W  [RES_0805]  (value not drawn)
R85  10K 1/8W  [RES_0805]  (value not drawn)
R86  100 1/8W  [RES_0805]  (value not drawn)
R87  100 1/8W  [RES_0805]  (value not drawn)
R88  100K 1/4W  [RES_0603]  (value not drawn)
R89  100K 1/4W  [RES_0603]  (value not drawn)
R90  5.6k 1/8W  [RES_0805]  (value not drawn)
R91  5.6k 1/8W  [RES_0805]  (value not drawn)
R92  140 1/8W  [RES_0805]  (value not drawn)
R93  140 1/8W  [RES_0805]  (value not drawn)
R94  10K 1/8W  [RES_0805]  (value not drawn)
R95  10K 1/8W  [RES_0805]  (value not drawn)
R96  100 1/8W  [RES_0805]  (value not drawn)
R97  100 1/8W  [RES_0805]  (value not drawn)
R98  100K 1/4W  [RES_0603]  (value not drawn)
R99  100K 1/4W  [RES_0603]  (value not drawn)
R100  5.6k 1/8W  [RES_0805]  (value not drawn)
R101  5.6k 1/8W  [RES_0805]  (value not drawn)
R102  0R  [R0805]
R103  0R  [R0805]
U5  NPN 3.75KV  [SOIC-6]  (value not drawn)
U6  NPN 3.75KV  [SOIC-6]  (value not drawn)
U7  NPN 3.75KV  [SOIC-6]  (value not drawn)
U8  NPN 3.75KV  [SOIC-6]  (value not drawn)
U9  NPN 3.75KV  [SOIC-6]  (value not drawn)
U10  NPN 3.75KV  [SOIC-6]  (value not drawn)

### Ports
OUTPUT1 (see 7, 8), OUTPUT2 (see 7, 8), OUTPUT3 (see 7, 8), OUTPUT4 (see 7, 8), OUTPUT5 (see 7, 8), OUTPUT6 (see 7, 8)

### Nets
+5V: J28.3 R72.2 R73.2 R82.2 R83.2 R92.2 R93.2 R102.1
+12V/5V: J22.3 J23.3 J24.3 J25.3 J26.3 J27.3 J28.2 R80.1 R81.1 R90.1 R91.1 R100.1 R101.1 R102.2 R103.1
GND: J22.1 J23.1 J24.1 J25.1 J26.1 J27.1 Q18.3(E) Q19.3(E) Q20.3(E) Q21.3(E) Q22.3(E) Q23.3(E) R78.2 R79.2 R88.2 R89.2 R98.2 R99.2 U5.3(K) U5.4(Emit) U6.3(K) U6.4(Emit) U7.3(K) U7.4(Emit) U8.3(K) U8.4(Emit) U9.3(K) U9.4(Emit) U10.3(K) U10.4(Emit)
Vın: J28.1 R103.2
NetD14_1: D14.1(A) R72.1
NetD14_2: D14.2(K) Q18.1(C)
NetD15_1: D15.1(A) R73.1
NetD15_2: D15.2(K) Q19.1(C)
NetD16_1: D16.1(A) R82.1
NetD16_2: D16.2(K) Q20.1(C)
NetD17_1: D17.1(A) R83.1
NetD17_2: D17.2(K) Q21.1(C)
NetD18_1: D18.1(A) R92.1
NetD18_2: D18.2(K) Q22.1(C)
NetD19_1: D19.1(A) R93.1
NetD19_2: D19.2(K) Q23.1(C)
NetJ22_2: J22.2 R80.2 U5.6(Coll)
NetJ23_2: J23.2 R81.2 U6.6(Coll)
NetJ24_2: J24.2 R90.2 U7.6(Coll)
NetJ25_2: J25.2 R91.2 U8.6(Coll)
NetJ26_2: J26.2 R100.2 U9.6(Coll)
NetJ27_2: J27.2 R101.2 U10.6(Coll)
NetQ18_2: Q18.2(B) R74.2 R78.1
NetQ19_2: Q19.2(B) R75.2 R79.1
NetQ20_2: Q20.2(B) R84.2 R88.1
NetQ21_2: Q21.2(B) R85.2 R89.1
NetQ22_2: Q22.2(B) R94.2 R98.1
NetQ23_2: Q23.2(B) R95.2 R99.1
NetR74_1: R74.1 R76.2 ; port OUTPUT1
NetR75_1: R75.1 R77.2 ; port OUTPUT4
NetR76_1: R76.1 U5.1(A)
NetR77_1: R77.1 U6.1(A)
NetR84_1: R84.1 R86.2 ; port OUTPUT2
NetR85_1: R85.1 R87.2 ; port OUTPUT5
NetR86_1: R86.1 U7.1(A)
NetR87_1: R87.1 U8.1(A)
NetR94_1: R94.1 R96.2 ; port OUTPUT3
NetR95_1: R95.1 R97.2 ; port OUTPUT6
NetR96_1: R96.1 U9.1(A)
NetR97_1: R97.1 U10.1(A)

Not connected (* = marked no-connect by the designer): MH1 1; MH2 1; MH3 1; MH4 1

### Notes on the sheet
- OUTPUT
- OUTPUT SELECTION
- MOUNTING HOLE
- FIDUCİALS
- DESIGN NOTE:
  Yeşil LED direnç hesabı:
  R=(5V-2.1V)/(20*10^-3) olarak hesaplanmıştır.
- DESIGN NOTE:
  Optocoupler LED direnç hesabı:
  R=(3.3V-1.25V)/(20*10^-3) olarak hesaplanmıştır.
- (in symbol SCH_TITLE) Title:; Variant:; Page Contents:; Checked by; Size:; DWG NO:; Revision:; Date:; Designed by; Sheet; of

### Library data of the parts
*#5 = SCH_TITLE: Schematic information
D14-D19 = LP T67F-P1R2-35-1-20-R18-Z: as D6 on sheet [06] - INPUT; Category: LED Lighting - Color; Manufacturer Part Number 1: LP T67F-P1R2-35-1-20-R18-Z; Case/Package: 2-PLCC; Quantity: 1; Supplier 1: Digikey; Supplier Part Number 1: 475-3760-1-ND; Supplier Order Qty 1: 1; Supplier Stock 1: 1903; Supplier Unit Price 1: 0,67; Supplier Currency 1: $
FID1-FID4 = FID_1MMC: Fiducial 40 mil diameter , 120 mil mask
J22-J27 = 66200311122: as J10 on sheet [06] - INPUT; Category: Rectangular Connectors - Headers, Male Pins; Manufacturer Part Number 1: 66200311122; Case/Package: 3POS_3mmPitch; Quantity: 1; Supplier 1: Digikey; Supplier Part Number 1: 732-4709-5-ND; Supplier Order Qty 1: 1; Supplier Stock 1: 56; Supplier Unit Price 1: 0,34; Supplier Currency 1: $
J28 = 61300311121: as J2 on sheet [04] - COMMUNICATION; Category: Rectangular Connectors - Headers, Male Pins; Manufacturer Part Number 1: 61300311121; Case/Package: 3POS pitch 2.54mm; Quantity: 1; Supplier 1: Digikey; Supplier Part Number 1: 732-5316-ND; Supplier Order Qty 1: 1; Supplier Stock 1: 109116; Supplier Unit Price 1: 0,13; Supplier Currency 1: $
MH1-MH4 = Mounting Hole 3mm: Mounting Hole 3 mm; Category: M3 3mm çap vida
Q18-Q23 = MMBT2222A-7-F: as Q2 on sheet [06] - INPUT; Category: Transistors - Bipolar (BJT) - Single; Manufacturer Part Number 1: MMBT2222A-7-F; Case/Package: SOT-23-3; Quantity: 1; Supplier 1: Digikey; Supplier Part Number 1: MMBT2222A-FDICT-ND; Supplier Order Qty 1: 1; Supplier Stock 1: 1957039; Supplier Unit Price 1: 0,14; Supplier Currency 1: $
R72 R73 R82 R83 R92 R93 = ERJ-6ENF1400V: as R3 on sheet [03] - POWER; Category: Chip Resistor - Surface Mount; Manufacturer Part Number 1: ERJ-6ENF1400V; Case/Package: 0805 (2012 Metric); Quantity: 1; Supplier 1: Digikey; Supplier Part Number 1: P140CCT-ND; Supplier Order Qty 1: 1; Supplier Stock 1: 76818; Supplier Unit Price 1: 0,1; Supplier Currency 1: $
R74 R75 R84 R85 R94 R95 = ERJ-6ENF1002V: as R28 on sheet [06] - INPUT; Category: Chip Resistor - Surface Mount; Manufacturer Part Number 1: ERJ-6ENF1002V; Case/Package: 0805 (2012 Metric); Quantity: 1; Supplier 1: Digikey; Supplier Part Number 1: P10.0KCCT-ND; Supplier Order Qty 1: 1; Supplier Stock 1: 2515107; Supplier Unit Price 1: 0,1; Supplier Currency 1: $
R76 R77 R86 R87 R96 R97 = ERJ-6ENF1000V: RES SMD 100 OHM; Manufacturer 1: Panasonic Electronic Components; Category: Chip Resistor - Surface Mount; Manufacturer Part Number 1: ERJ-6ENF1000V; Case/Package: 0805 (2012 Metric); Quantity: 1; Supplier 1: Digikey; Supplier Part Number 1: P100CCT-ND; Supplier Order Qty 1: 1; Supplier Stock 1: 728141; Supplier Unit Price 1: 0,1; Supplier Currency 1: $
R78 R79 R88 R89 R98 R99 = ERJ-PA3J104V: as R1 on sheet [03] - POWER; Category: Chip Resistor - Surface Mount; Manufacturer Part Number 1: ERJ-PA3J104V; Case/Package: 0603 (1608 Metric); Quantity: 1; Supplier 1: Digikey; Supplier Part Number 1: P100KBZCT-ND; Supplier Order Qty 1: 1; Supplier Stock 1: 11465; Supplier Unit Price 1: 0,11; Supplier Currency 1: $
R80 R81 R90 R91 R100 R101 = ERJ-6ENF5601V: as R11 on sheet [04] - COMMUNICATION; Category: Chip Resistor - Surface Mount; Manufacturer Part Number 1: ERJ-6ENF5601V; Case/Package: 0805 (2012 Metric); Quantity: 1; Supplier 1: Digikey; Supplier Part Number 1: P5.60KCCT-ND; Supplier Order Qty 1: 1; Supplier Stock 1: 71341; Supplier Unit Price 1: 0,1; Supplier Currency 1: $
R102 R103 = CRCW08050000Z0EA: as R4 on sheet [04] - COMMUNICATION; Category: Chip Resistor - Surface Mount; Manufacturer Part Number 1: CRCW08050000Z0EA; Case/Package: 0805 (2012 Metric); Quantity: 1; Supplier 1: Digikey; Supplier Part Number 1: 541-0.0ACT-ND; Supplier Order Qty 1: 1; Supplier Stock 1: 609778; Supplier Unit Price 1: 0,10; Supplier Currency 1: $
U5-U10 = TLP2301(TPL,E: as U12 on sheet [06] - INPUT; Category: Optoisolators - Transistor, Photovoltaic Output; Manufacturer Part Number 1: TLP2301(TPL,E; Case/Package: 6-SOIC (0.179", 4.55mm Width), 4 Leads; Quantity: 1; Supplier 1: Digikey; Supplier Part Number 1: TLP2301(TPLECT-ND; Supplier Order Qty 1: 1; Supplier Stock 1: 19225; Supplier Unit Price 1: 0,73; Supplier Currency 1: $